# Altium schematic sheet Power supply.SchDoc (part 4 of 6)
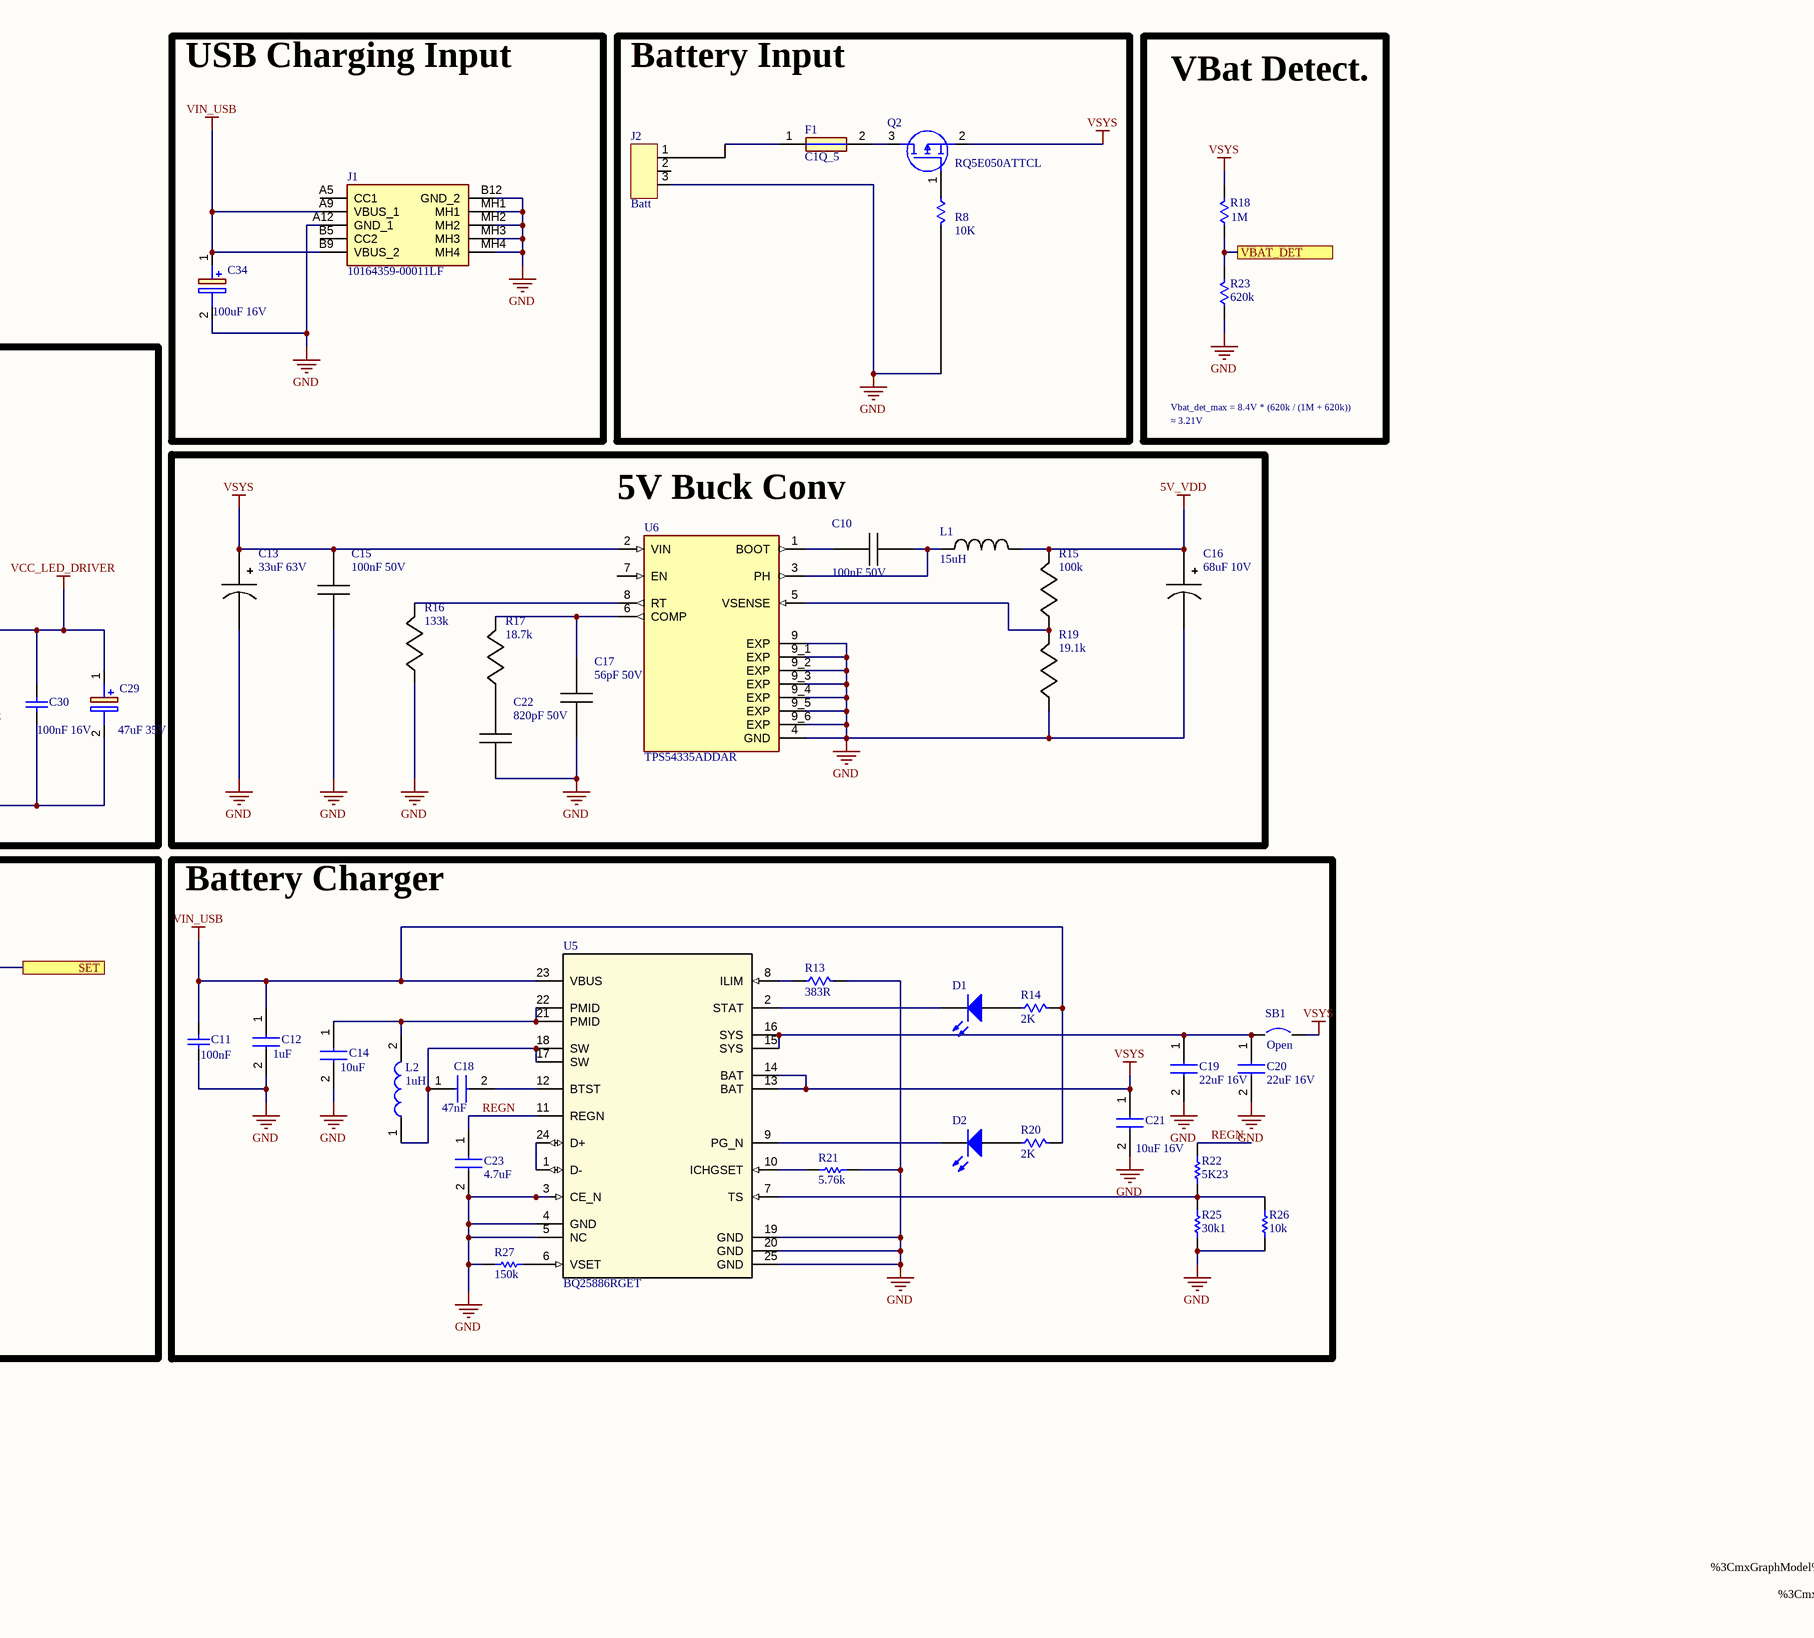
[diagram p4: Power supply.SchDoc, right]

## Notes on the sheet (continued)
6ujk%2BrQpmSkpIYIsTFxZGso9Vq4%2BLi4PyY0S9TFKUXdE4dW%2FUEgk47WcdUoPMEQok5vrKhoKNWSk7myc78%2BMEFTcS5Y3NPHhxPIg6kuZeuVidt2LQ9Izl1%2B5qUzQnJmxLXb%2Fl6TRI36JQVf%2FHvf%2F%2BboqjftOUg0YG9ijR9Mlr79HumxQKCsHRFm6M7FegMG2IHKzhlp6JBnKNRudH6Ae2QlOiAQKg4z%2FfnM%2FEgFMnZ8QaNdYrzfMtORd%2BsOAre3a6UJNMEPxqVW8eDTujsUfDFseZkHVycHXBe3LNnDwE5D5NHjx7FAtyJpqamHw5tXjhXBFHwdaUXv0wFOkbvuiIg52EyNTUVn3J6ejrkLl4c5Slx4QM6G9YtbSfowNLV781a5ouef87ejNlqlbvm0IwOWLrCl4Yu%2BY2ufLxQAB1sio5PRIaHgmXhtWvi4NONAB0m2dByuEFn5uw5KWnb%2F7lpa0LKptXrNiYkb5rxwSxmbweJzupVn8HNLxZF%2FqYtJ3V0wFACRxsKoENDHDjsVKBD7pMCQKGJczzchoJpdhfnh0rKJOg4OYrjl76MZLNr03DcdYWZfBIkZECPFIlET9t1xd4Jr0WRSNTfvoeTo7id20%2FAjk5MxEtYt12bhtM0kwoLj8DcRhPnAOnwF%2BqAU8%2BFc0WCU0%2B9iAMFTA468%2BfP57%2B9vLy8nAk6MTExWq0W%2BgN5NmphZElJiV6JjkUpI4eFeHck6Bgt1zEadEYP750U55y5cURSnLOwVoWvUIMS4GiMoijU5NULOi%2B%2FZDfJ7z8NitygExAQ8MGs2V98tTJu9dqlsXHTgt9jUk5AQACAzvJlUVMmORzOcv359OL%2F%2Be%2Ff%2Fue%2Ff2ts1GIUdHRYUYY709JBx4jt5cOG2E15y4GGODAwGhu1QMfY42mg4%2BQolrr3xcutCHRoNae9CFBTJz4%2BninRIX%2Fi42991sT9%2B%2Fdv36qqr6%2BFiPMla2H%2BmTyhwRqLmQp0%2BDcmWdIg0FmyZEl0dHQHgM4u%2BYaamsqKG6Ws73qemf5%2BL6IdnfZsL%2BejjEwbTbrkN7ryOXRuaHfGQwCjKZMcUO9YrXQ%2FnDVGMA%2BITcQ%2FwQSdIk0hemxl3qeXuEvXrjZGxMWLIyiKmhYUyLMPM4sh6Dg5iocNsft0%2FvSy0pKy0hKcuWpqKpkVJnMEHR1W4umEoEM%2BdVoauwvmM0EHT7W8Rn3s160YZmgMm%2F08eRMnR7G5JTqjRg6x79edI%2BLkd%2FDgQSboPN7JuLm52RoJhmedH2%2Fbkio4KLxJSEjA%2FqBQKDC%2Fw0Bna1pyTU1lOwWZpMHADgYdI%2BQ6xkl0gHKK88ZfPrO8OG88sA5NWEt71QiHzBZYuyZOkZW%2BNS0Zft8i9zQ2asE3CPMS43LA2bipQAfrEBoyjfb7HE8xE4IdHasEHdO6gGhs1II%2BF%2FR46JeNjVoU8DD7jUlyDAKdCRMm%2BHGG8ePHkz8FdBkMBJU0kUiUn5%2BPE9u9e%2FdoQh3%2B61Z4E5MneEKDNRZ7vKDT3NxMU0aOiYmpra3FJ6jValNSUoB1AHT278952q4rR4yKCid1dPz9%2Fb28vDw5gy7LyGQ3NjT9eEHHUNYxAnT%2BYtcVQAdMId%2B7UwqHglCHzzt5%2BbIoRdZORdbOP9zOk%2BWRcgAdTMs6JgcdF2cH2FIO627Ll0Xp1dERQOcJBR0XZweIIOh2chTDGqciayf0dfiryEonx4Np0waBjo%2BPj0Qicdcdxo6lO%2FVkdQEx7OX%2BSz4Pv3q1HGc1SNy7d%2B%2FChQtJSUmpqamPfRqGKlkjwfCssyW0cHl5eW5ubnp6Oom82Cu0Wm1%2Bfn5KSgqAjhEuILy8vDh67NixYzsl6BjEOkaDzsm88fikBNDh%2F1pG4T0qIDs5immUY3LWMTnorF0TR05SkObedSWAzhMKOthRSBamUQ6UMR%2FrGAo6HDOHVCplgg6repqZDAaqC3cv%2FbQPxIqKCnwLtyfBExqssZipQKe0tDQ4ONjT0zMqKoq%2FMjL%2Fh2K0ZWRw6qmrx44dO9bb27uzgg5%2F1jEGdJ56KNEpK46688vJCyfmAegIppD54A6CDi5OsVIOvPlNJdcB0AmaOpmHFx%2F2ItOmvUtRFPqZdnF28Je5khG30ehqBLteXUCWL1hGJonH0nV02r90hV0ZewYr5ZiVdYwAHS8vL29vb5%2B2ASjnMYIO7LqKXtBH2HXFk7pMCDod49TTUGVkBJ2xY8f6tw1%2Bfn7eraETgw5P1ukl7mLQqwzAKCnOGeAG%2F65c%2Bgq%2Bx4QERwsUaQoVWelFmkKQ6HBQDk4QiEQct%2BU%2BBaDjJXl1zJujdEvkdZ5xdR3jJXmVBB3uj2M9K4AOyTeYtlzQmTRpEpAp6%2BPkn0lRFOjlgESHg3LMxzrGgY5MJqMpLox9FMh82F7ObBBzSHSamprKLhTkqxIg3rlzh7%2FMgKMkT2iwxmKmAp3a2tq9e%2FfK5fLCwkKDDAZyNDt5qv0SHW9vb7JbBgQEPCGgo5d14D1mBOgMG2IXEz4YKUdw%2BMB8y%2FHJ0Us5pmIdAB0Pt6GDBtpJJG6eBoZBA%2B083Ia2E3R6iR9KdHCOFxIW7QJi%2BvTpJgEd4HT4q5dyzMQ6nQZ0yKnRhGlrJBiedTYV6JiwtVlvJYAOnymTo4yuveVoNMsI0OH4OOEUzxbgSTkmYR0EnTdHu%2FgaHtxcRwqgYyYsE9VbajAV6OB44Ek55mAdAXRYJ1fM5AkN1lhMAJ3OraODrxe9ch0BdMi26pg0kAe80nn%2BLSstMbpu8HGT354gMzZMnTLZVBIdS53YH0%2B9LBd0wsLCTCLRgV4L7tB49nUohhphRvd7vFAAHWQa1oQ1EgzPOgugYxzozJ33yfxPw2d8MJO2HIaHPLeXB00Lnr8gYv6n4XghLWGEwUAc18wEh1xHAB1mc5k7x6Aftzg7GF0rAB0T2tHxl7mC%2BR%2F8S24iY61nzx62IpFo4MCBjwcoLPVTLRd0VqxYAaDz%2FHM9WZ%2BoQZlojQB7M1rUxhxaoj1oT6tbZwKdn8tO7kydCfHGjcus4GJoJk9osMZipgKd27dv79y5c%2FPmzd9%2F%2Fz1pCMfQptZV3iRLV7SdJL6%2BvkYoI38Y8jf5XlXmXlXGnty0jO%2BWxcXT0AQO%2BYDOV%2FEJmftU8r2q9O9zUtN3z%2F7wr8xbmRZ0OOQ64O%2BF9mbQdUju0pK69Z0ZNEDw%2F6CrrTjyg4NktLe63sP27L01OehsTUtmVph1jy02ggA6rKxluaCTkpJiQtAxaKUW%2BlaRphB7TzsTxoGOr68vzXCgt7c3qCOT7%2BsOVkYu%2FDFDcOrJH7lMBTpGO%2FXURTa0%2FPaDjo%2BPD1MtYdy4cYZKdNK%2Fz5HvUQLobNu9Z6s8a%2FqMD8gOzxN0PvnHgvTvc%2BV7W0BnZ1b2t7u%2BX7f5W%2BZ9TA46HKzD%2FzUCoDNsiF329lGojJyW6CLsLeffhlAyMjwUNqMwiYGZo3fLIfenmxx0nBzFsMMcfqjX1FRyU46To7h7txaJjouLC%2Bt8%2F8RmWi7opKenA%2BgMcDCBRMdf5srs1tw53HaZuHs87awRoMM6bcBP5Me7vfzokTRFxt%2BTV0m%2FiR1eXV1Nmy%2BNO%2BTPDVZX0oSgExwc7OHhMW%2FePLPa0VEqs3v2sOWIkZFtLCPD9nJd3dXX13fcuHH8t5fP%2FjBk%2B3d7d2Tt251zULE%2FPzV995adu2K%2FXsUElL%2FOCT6UlwvjmtUFxNoNqdu%2F27tTkb0374edWdlwq6lBQbRbTZgg25qWTBrZog1e4w51rWHxvBuADkk5gDtpiS487yAU42gBbqeeHBdynzIH6KD%2FB0VWOlq%2B5agGgI6Hh8cTyzSsX%2FxJAR1A49CQaZHhoWSsqalsbNSSOZDm6ElGnDIIdHx9fTmmDZg5yJe1RqNxeW0w02b%2FxAnj%2Fv3vfxtHHh18ldXhC%2F8Kmwp0zP1EUKKTk5PdvZstR2SCznh9wd%2FfH3vs4sWLOXxd%2Fe2jsLSM77bs3LUja1%2FGHuW6zd8mp277LCYWL8fE7l3pFEXB2gQr6MQnrkvL%2BG7zjl1ZykObd2Su27ItOXXbe9PfxztAYsIEWWOj1oTiW3w%2FtId17Hp1%2Bcsjg4HVVzKam5trq48A6whrWNjCRiceF%2BjM%2FfiTz6KXfaJbY4x06unkKGYuXXH4IoXWEEDHykAnNzcXJDoGrW3r7fr%2BPvZpia%2Ft2jQ8MmzQsCF23E499d6NZwGDQIf2ItZ7qMvXlVQq%2FfejYO5psp33588NVlfS6kAHpPdT3nJIS3TJ3DSCabtl%2BbIo0teV3v5JK8ANOpMnB27clp6StmPtxtSE5E1r1m9euyF1zl%2F%2FRrtJQECAXtAJj1q84dv0dVu2rVm%2FOSF5U%2BL6LWs3pjHvQwOdiLAX0hJd0hJdZgYN4Dm6OYoZzTotoPPI1xUOLgAdk1SMo85PwikEHX8f%2B6S4VzM3jowJH4zLgna9unCAPsepqKhwDu%2Flqem7Mvftl%2B9Vpiuy127YMjVoGrM30kAnOEhWVlqCmsjwCwEe0OjhvZk1d3IU29raiESi6dOns873T2ym5Up0CgsLAXTs%2B3U31dib8paDRuWGcdem4fV3azgc3%2Fe372FcpClQmxt0WBdug6aMf8Q5D%2F%2FjG9PSElaHL%2FwrbI2gExMxWK1yx0hbLjEr6AQEBHw07%2BOkzVsT129JSN6UkLwp%2BssVzPmAD%2BhMnjx5%2Bdff%2FHNj2pqUFtBJSN40Y%2BYs5q1I0ElLdEGFGLXS3SRmiI1jHVKic%2BeXk4JEx1RTANwHQMffx16tlGA8nOUKnuG7d7P9i123N17vbVC0sbHhAJ34xCT5XiWAzvbde7fKs%2BITk5i9kQY6INHB7w57h1s8QjBqjpQGk6YAOjSkswLQ6feMyUDniOJNjcrtxuXv7tRVX9CEa1RuzQ9uc4BOS6exsTE4ikTP9u%2BBvdPkgoGWAAAgAElEQVTJUWwhoIPc0x7QKbuo2bLubYjXr11qz63wWv7cYHUlLQd0tFotNjgzcezYsSVLlqxYseJQXi4gTk3F0Tt11eeOfaRWuZNSBHODTkBAwIyZsxYsXPxp5KJZbPukYHrQK9EJCAh4e%2FLk2X8NWfjZ0k%2F%2BEf7ulKnMeSUgIABBZ8okB7XS%2FcAuv%2F%2Ba5Dnvb7If90gOZ43B%2BYMczoamkXX4X2jXq4vdU10zN44gwUutdM%2FZPor%2FTYSSuloAQCd7%2B2i1UnLrRs79prtlxVFqpQTkl9272Y5174cAxDPBDTo7vtu3U5Gd%2Fn1udn7B1kxFavrulLTtzA5JAx3YHg9rWKB3QVGUv8wVan7jclbLRKaOUCslK5cOhS8LoBMWFkab6Z%2FwQ8sFnfPnz8Mz6%2F10V1391aD8YUPsNCq388dC4ZHfrj7NB3RCZjju%2BXYk%2F7g%2B3llkY2MJoOPkKH7N2eGL6HDkG0hcvXo1KioqJCRk%2Fvz58fHxt27dYk57unKampoKf8wAR1cL54oqKyt1lTQo3%2BrwhX%2BFTQU6RSdyIz8SRbe6U738c4lBzatQKGJaQ1xc3LFjx2jXlpeXJyQkxMTELFwY%2BeDBg%2BobP6pV7qXFMTBMqq7uV6vcYyIG41jrANBhTgDMHD6gw7yKmYOgA84WlHtWenl5BQQEbEwYq1a6%2B%2FvY4xdvT4LcLs7nPlBe6taXZJ2c7aNA5MDnDkIZjhYA0FErJeeOzoLh0NhQqVZK0hJfh41LrKBz8uD4Mz9%2BcObHD1jRhxt0tsqz0jK%2BS03frdifn7gh9Z%2Bbtq7bwrIHUBfoUBR1KC8XJTpqpeTU4UAYoXfqqtVKSebGkU6O4gEOPWHSXLFixRNONrSvb7mgc%2BPGDXhmT9uZEnSK83xrb%2F9cX19%2FrfRbPqCz4KNBuNTFJ7Ej%2BXXLAR0Y6iEfTkHWuXXrVkjbMH%2F%2B%2FHv37tEmP12HTU1Nh%2FM2p657O3Xd28mrpNevX9dV0qB8%2FtxgdSVNBTqaEzm4q%2F%2Fq1av8mzc9PR0oB%2F%2BSrFNeXo75Q17sQ1HU5bLDapX7qcOT4U1xQROuVrmHzR6I00ZnBZ2ZQQPUSvfcXe8D6BzI9FAr3U0i0XFyFBsHOk6O4mFD7Px97MNmDTQVcuFzfJIT%2F5%2B9d4GLqlob%2FwczlV7eLP35SolRr5FCXjpmOkCMOMAk4zmaxzMqnvBkHMrOqx3IKEMmNae0RDgIhQooOooGxwuMiqKiWDMyeB2BBEUF8YKkMmSGv%2Ff3%2BX%2Fm3%2FDo03Lf58JlYK%2FP%2FsDaa6%2B99tprr73Xd571rOdB0Cndp2i6ffGXX36pr9mJchG6ROf00fdg1EC2qLuwp%2BzAmyTxcIPOoiXL0jdoV69dn5i2ZmVq%2Bqq0tR99mkDHbkbQoawOBolOaWFY%2FeUjt2%2FfvlSVq9cFpGheFkGHAjfkbucFndu3bwPoPOH%2BmLPeSfWHQwy7pcZ9IcZ9IUAt3Do6EomEDjrnTi6vv3zk%2BpXj168cP29KPXl4FglAnRB0fH08amqqgXXWrVv3KOdY9%2Fbu3St84GyLnC6HL8Ir7CzQqTp3%2FKQxDzbhBgPNZjNyDEY0Gg0%2BRJDlwKHZkTPhh6NVVWW3f%2Bm%2B0NJ9oTCNRb6AXRV0fH088luN1hRvD4AJI4pyEtkItsbtBh24kCjIsbXBufMD6LTK8AJKC8NKC8MAWYBrKaBz7uQKcsjE%2BE%2BNV04W%2FxVZhxt0pkyZ8sXK5OT0TCvorE5f9nXS5MlTeEFnhsq6JJDcQNFi7uzn9DprzRG2YC3ewAG9YdBMS0vDeooRK0t05lZwOuj4%2BngsmPtAQpO%2FcXS4fAD3qisK6OC0F9loPzVeOXdyObJOJwQdby%2F3kiMHAHQWL15MB52UlBQU%2BeAQ2J4R4dzgcjmdBTr2PQ5SYIOgo1arUV%2BHTIyPj1%2B7du3%2BfQW%2BPh7LFw0FxMlZ8wpFqtFVQcfby52cKkrR%2BHEPljYdtRt0rA9C56%2FX%2BR%2FIHauO%2FX0C0aari5kpLQCg4%2Bvj8eHcF4BU8rPHoMyMBJ3TR98jv%2FaU%2BPUrJwSCDmqMcWueUSQ69OXlFosFlp7Mnf3cgdxxel0AWXPQBpNIJFqtllLVbr7bqUHnueeek0gkvR7vQemmTtwVDjrHHwrzGXtMZVkCsE7nBJ1Tp8oAZVasWEEHHa1Wi6ADEfuGVbvPcjl8EV7hjgWduro6EmUwjk%2BKlOjEx8cnJCTwGod1IugEBweF2Bs2bcxAOzqfqePsLSZk%2FPjX28iODvmZsg90UjR%2BFGVk5%2BIXWcNuFQfQYbtlEnTIGSvGL%2F%2B5kyuAdbglOnThDWMKBXTCFeOWLo4DO4T19bVLF8dxW7bs%2F3QvkA6UlJQw1rbbJroA6PR8zI2tRzqeLhx0uHv8T41XYDqsQ0DHz3fIE%2B6PsW2%2Bw%2F4b8KWlpeXs2bN00Ll69SpmICM4HLZ1RDg3uFzOjgWd%2B%2Ffvp6WlId9AJC8vDx%2Fo0aNH8ajdoBPOF8hvOmlH58UX%2Bo197VV%2F24PPkAHwYxcMBi6IjfYdOsj2YvzHjRv7%2FHMenRZ0gHJOH3237sKes%2FpY2BUNBjr%2B2RcIOqWFYbxkUH%2F5SNuBDt4pzCnjLluk75M9AXQuXbrEW%2FNulaFTg05gYKBEIrHJ6y9bD2BLFwg63OIc6DEwgeU46ISGhgZxBroLiBeHvNDzMTfG7YUXnm9oaCDx5fDhwyTrnD17ljxKj%2BOgCJGff%2F4ZU8g4JtoRcTl8EV5hZ4HOj5Wl%2F94y%2F99b5h8qTDxfXSG8kevq6kjW0Wq15LlmsxnXZAHo5OfvYuxImBgbG0MaDJw4cWJgYCAHZAQGBrK5gLDaK3%2F5eXDfJvzv2NdGodFYBB1vL%2FcA%2F7HCC4GcfkOf9fZy75yggwYD4fPSurjGOodFLvVn%2B6yJ6dwtIBB0uOetiOdiNcbTFhIdMBiIjq4qK0zHDCUj%2FDzZ7u5Jjweg060gRsjNdmrQiYiIAD5le66OpwsEnUpjAm9r1l3YY9gtdRx05HL566%2B%2FzjZyBAQE0EGH0WBgwLihqJpDwZc7d%2B4YjUZexKGcdf%2F%2B%2FV9%2B%2BeXQ%2FrW4%2FEdcXs5LPM4CHeOx3dDsCTFPnT9%2FnoQV3rjZbK6urjaZTGxazA0NDUVFRQg6bKJBSI%2BLY%2FB1xcY6gYGBHE49h700MMSu8NqYERSJToD%2FGDtKmhA8fthLAzsp6Dx0AXH9yvHbt283XD8HEp1pk1jHOce%2Fh92kBIGgc7L4Ld7PfutzaSvQWRAbTWoiNzebuf16PuH%2BGIyYvNXubhk6Neh88cUX8Ngohoad%2BDYKBJ1zJ5fz9oz6y0ecBTpBQUGMrAOUIxB06JaRKeBix%2B7du3e%2FP7JV86l3Qkxf0Y4OL%2BXIZDJngc7Rw9uWxHnDduYU1RYOL%2BvwZkBfV7bq6IBTT%2BixdEFkcGtgk%2BhMdCBsJXxdfb5UbXdJCkVo5wQdj4egU1oYWmFUo7KOE79%2B3bao6KjpeblatttHHR0hU1dWQ1Ot5pXbQqJDV0bm9nXVp7fVdflzzz3HO1p1twydGnTS0tIAdJziwJyxW1dWmCorTIyHwKIxLC8%2Fa4jl7RlgmMcpEh0YMEJDQymfb5TMk0oPBoOBUaLTRqBT9aO%2B7FjuceuWJ05d8bKOs0CHl1QczOA46AQHB5PdUqlUhoaGcoMOJb9Nu043GMj2EXBKun3KyGDaBxHHiQYMnXJTXbUQBB29LqDuwh7uLz8YJm6jqatwxbi8XC1s9fW1FouFY7QCU4cSiUR0XU5%2FZJ0adLRaLYAOxdCwE18wjvlOEnSM%2B0LobUdJAZ8SdNABTXjSvjMuAgR%2FpZUVJvITL5fLAXQUCgWZrlQqOxx0KEIgBwdXPJ0XF1w3gwg6HFNXlO5t0253AB1vL%2Fdw%2BYDli4bmpL%2ByfNFQyjp%2FJ34GxaLIFiBBBw0QU772sIuayG0EOlirEX6eYDYQUxgj4NFTqVQy1rY7J3Zq0EG%2Fns51YM7YRRgTSTs6NRXrOTpKw%2FVzjMvLgXL69H5khXyXAR3kHkQW%2ByKuyzG8NRdBRwQdRywjM36XxMQ2bQESdPS6gJPFbzEuucVJq7abupqhUuTlboJNiEQH5AKioyv6SN2pQQe9QDjRr6dNbwgJOsZ9IWBym96IuLacoqPDSDnw1YMe6YoSnfr6%2BvT09KSkpO%2B%2B%2B%2B7atWvIOi0tLfZRzv3793lxwXUzOAt0mpqa7txugK2pqcnupmY7UZy6sunLYGtm%2B6aubL2KmN8pLUABHbBBXH0m7fqVEz81Xvmp8Ur95SOtWlO%2Fez5vI4kOXUcHDQYy3ikMK6KjK%2FoY3alBB71AOMvdlbeX%2BwyVIiszFbYZKgV0l%2BRVGkihKLuQoAO%2BI86bUimNCIutKJaRn37qcTbKgXQXBZ179%2B6Vl5dPmTJFJpN99tln58%2BfJ0EH4mxDKUe663IMb82dBTqw6ioh5qnEz0dVnTvD0Zj2HepUoPPe%2B%2F%2BT%2FO26FUmrP16kZpvPEjh1tVC9OPmbtSuSVr%2F9ThRjUejUk3HkcFaiCDrOasl2KIcOOiCz4f7bFsrINt0s%2Bn8QzSJTxujO7gLi9u3bffv2lUgkTnR3BQJAmO9sbjZHR00%2FZihBr2kUnXYK6ADNGPeFnDkaXVmWcOZoNPINRkBHBziGMmPl7eUOlNPr8R69Hreqx3NLdMLCwiiW2DpcR%2BfevXs%2F%2Fvjj5MmTFQrFV199VVNTQwcdO3CHFxdcN4OzQOf7wzm4qr%2FTgo7i0RASEmKHMvLnK1Zu2bE7Z%2BfuLdsLNubuTPpmLSOgCAGdDVv%2FbS1nx27tv%2FOzt23%2F54cf0YsSQcem0bQ7ZHZ10BHNIrse6DjdCwSsJx%2Fh5xmuGAfmJkGVfYSfZ3TUdIvFsnRxHL7MjKCDTMMYQdBhoxxIf2ag1fsaB%2BjIZLIQWpDL5cA65Pe6PVddsWENR7oQAYPrcgxvzZ0FOnWXy8tNRRWtG3qqEtK2AvM4KNFh7K4hISFyudwmHR3V9Omb8nZp%2F50PdLI%2BJy9zc%2B4HsQvIDg9xXtBZtGSZNi9%2F8%2FaCLTt2b8zdkbUlN32Dll6OCDr4uRMj0AK9Hu%2FhZleIi4u1WCzTVW%2FSu5nAFIoLCJueCJpFPnPmDH2k7%2BYpnX3qyunGkevra3GFHoBOfX1tc7N5%2F74CEPZER03H7iWRSHyG%2FMek0P8it4RYqwt02Lav%2FwN5aFLof40e2Vfi5sZNOd5e7tygwzZswMjRgXZ0OICG%2BxD3cMuLC66bwVmgw92Ajh9F0Nm5cyfII9n%2BxsRQLSNzdFfosWx2dOhf%2F3%2FM%2F%2BeGrf%2FesG17rm7%2Fjn2H1m3KWbsxZ%2FEXK%2Bg5eUEn%2Bdt1G7Ztz962I%2F%2FAkc3bC9ZuzFmTvSXyb29TihJBBz93YgRaYED%2FXv2ftmdTJyzoQNARzSJzwFxnBx37jCP7%2BniwvbR00CGnriwWS7hiHJ7eo4cbZfvNMewQ7yfC5QNgGzf6Kfp4wEs53KATxhdCQ0PJj7XBYPjdBUTP3x1BBAeP54aP9j%2FKNh67Lsfw1tzlQEen28X9lV8Uv4B0AREeHk6x9kTfDQ8Pxx5L%2BrrCRIzMfvuddZu2rsnesnZjTvoGbXJ6RsqarA8%2F%2BRQzYIQXdL5c9S8oJEO77V%2Fpmf9Kz0hZmzUjYhaWABERdNg%2BlWL6gtho2Eb4eWI8XDGObJlwxThMAe%2BbHSXRAXUIiaSzj%2BkcONJ2hyS3Onf4%2BOOPgSQE2gz09fHIzx5t0EkNOmlm0nC65Qk66FgslmOGEm8vd5i6ulyZbNgtPZj3mvrDIWSHhrhEIiE1o1H%2FC3FHCOVwgw7lQ8y7azAYhg39b18fD5l%2FP9yecH9MERbcFijzyy%2B%2FXLtaBdsvv%2Fxi3yUoxMOLC66bweVAx1bLyLz9k5KBG3SmTHkzMTU9dd2GpG8zElPXJKatSfp23Z%2Bn%2FYVSiFKp5AWdyL%2B9%2FU3WppS1WavS1iamrln1zdovE%2F9FL0cEHfpXrsuk%2BPp45KT%2FAZSIM5NG0ocDjjtdEBuNupt5uZuam824i1J%2FcLWGUwROBB1fH4%2FMpJEVhv%2B5Wb9HYM0BdJ577rnOPaR3TO06O%2Bhs2rQJGEKgKZ2Dua8ZdNLjByYfPzAZWIfSlWGiqrLCBB03eZWGklJ14uOTh2fBzBSddbhBRyDlOB103pw0EipM1ryNLCOjryvNp961tbX2gQ6chbjjuhzDW3Nngc65ytKM1ZNhu3DeBqee2MjcEZy64gWdlV8tJCU6dHTgTuEGHaVSOTNi1rKvVq36Zp0VdFLX%2FG3OO4wF8oKOUqmMnvuP5PSMxFbQWfLFV5OnTKEXJYIO5QvZlXZ3ZY%2FR6wLKDrxZduBNvS4gJ%2F0Pwu9uhJ9n8ioNyPgBdGaoFOGKcTBewAJeQJ%2B2AB2o%2Bc36PRaLRa8LyM8ew1tzGCgDAwM7BiU691U7O%2BgcOXIEnp8QUzrTJnkadNKz%2Bphbt27dbKg7WTzLoJOGyweQXeSYoQTdpIG7k3DFOOCe%2F%2Fe%2Fd2vOfF57fvetW7duXKsEuQ55LthKZpPoCKccp4OOdk2YYbcUan6zoQ5qPjFsbMmRg4wgcu3aNWNruHPnDmMGtkTwdYXLfxwEHcQdXlxw3QzOAh106vnRexJbnXrev3%2B%2FurraaDTW1dUx4k5DQ0NeXl58fPyaNWt4Qaes5Ks2BR2lUjl5ypTpMyNmvRVJ5xJMEQI61qImT5k%2Bc%2Bb0mTPxREpEBB3KJ67L7IbLB%2Bh1AWf1Hz4cDv6q1wVQhgPumwUJTaB0GIAOmNGHEQRkOQA69fW1MHvlLIlO3palrYYK%2F3r%2F%2Fn0UI0GEsi6YrD8MlBEREZ0bOTqmdp0ddC5evAjPj8QL8umS8bmzBxt00gvlWdCW504sN%2Bikwp39ZiYNN%2ByW3rhWCaeX7gsx7JaS5XOATo8ebpScsJJ89Mgn1R8Okfn3oxzlUEamfIh5dw0Gw768SWTNQa4DmkYTw8bW1FST4LJ3796oh2HevHlGo5E8yh2%2Fe%2FfuldofL1QbYTObzdz5BR51XY7hrbmzQOeYPl%2BbEanNiFz9lazqnImRVxgTzWZzYmKi%2BmHQarWUbHl5eXDw71GzQT2f0lcpuxXHE9sadHj7vJCpKyGFKJVKEXQoz7fL7LZ6CguoPpMK3%2FPqM6l6XUCkapDwG6SADthas1gs4AWWRBD4eQD5YWHv%2FV%2Bv%2F%2B%2F%2Fbf7%2FWsP%2F%2Ft%2Fm%2B79ev32rHg5x%2FIV5hj07NXqdteYAOj%2Ffqbp9o%2BTU8X379xWw%2BSId5NkHBsovvviiY1Cic1%2B1s4POrVu3hJvSCZcPMOikJ4tnXasru3LpMGjqCJ%2BXVX9oXU5VYUy4ca2y9vxuw25p%2FsbRlLeCbeqKIs55%2BqnHJW5uMv9%2BMKN0MO%2B1aX%2F0JItyLuisTZIbdkvPGmIYa07OYZ09e%2FYh5Dz4P2%2FevAsXLggkkjbKxosLrpvBWaBDoRPhuyTlANCQrFNUVPQQgdQvDxsoBHT27Fwmgg75LguJiwYDhbSSc%2FOARKfswJvX6o5fqysrLQzT6wIEDgdZmamB0mEwdYUSHSSbcMW4EX6egdJhgdJhzc3m%2BvpaqPkMleKYoQQcRTfeOPdL83lyu3ypAg7x%2Fv041jrRVloYdre5zmKxCKk5aoseOXKkcyNHx9TOBUBn%2BPDhEomk1%2BOPuItieyVWa3yBb%2BCvOpZBoZjtXKsi88bRgCbwly7nFAI6g5%2B1wrXMv1%2FpvpBL5767dG4bzCXhYi6nT12FyV%2FmrvmpU2XAKCkpKRTQiYqK0mq1bUQwAot1XY7hrXnHgk5dXR1yDEY0Gg1ykkajwfR%2FvB99%2B%2FZt3qmrpYvjRNBh%2B4awpYugw9YybZqeonmZNGesjn1RyOVQxRjIZoSfJ0xdBUqH0Z1ANzebUUeHLBwwC69%2BIPeRtVpkTsb48kXDrLNXh%2F58pTrz%2BqXvLlTkzFApRvh5kmbeyBPRiM7Fixc7BiU691VdAHRghTl9boh8zBj39fEIlw%2FITBq%2BWuM72xYpJZTg6%2BOxYO7zmUnDVyx6icL%2BzwzsbZXTsKy6IiU6IEVckTD00rnv4OlXGBN%2B8yBBYpNzJTqB0mEcNff2ci8peaCss2LFCjropKSkCCSSNsrGiwuum6FjQcdkMiHHkBE0OUgmxsfHJycni6CDHxMnRkTQcWJj2lRU63AwMkXzsk2TVrjkCtwEgc8pxuseM5SwTSeFyweoY1%2FMTBr54dwXGM%2FlTgyXDzis%2B33lF6iWsvm6QiM6nZs3Oqx2LgA6X3zxBcw%2BcneLtj4Ks1ESN7c%2FKv4rf%2BNo2L7%2BbKjEzY1iIRBAJyF2yLkTy%2BHBgrMIUlPH6aDDffuoprN582Y66Ozdu1c4wVRVVb377rt%2F%2BctfPv%2F8cw4XEMILbGlpcV2O4a15x4JOQ0MDiTIYR4lOWloaJsbHxyckJIigw%2F0q2XdUBB372q2bn5WXuwnIBnWf0T8jpWWecH9MIpGIa8vZSMoFQAdXmD8zsDfl6bbnLoAOObGF8dEj%2B4JEZ%2BniuOio6QA6JQezbtbvPn%2Fma%2BtCd5q6j3NB5%2FnnnwcWZPwbGRmJ2HHt2jUK6MybNw%2BP8kaEOPXkLYSegRcXXDdDx4LO%2Ffv3UdcYgcZk%2Bl2Xubq6GtMRdAZ59uHY1AmPGAxUKpUhfEG4wUCBGsSiMnJ7fvrEa3VUCwDooMOirMxU%2BtwZ1K3nY24SiURcW%2B7CoGPTCvO265FCQAeWqQ%2Fy7HP48GGY3%2F1%2F%2F3vXdDQyf%2BNoUkGHW0dHLpf7c4agoCByPDAYDCOGv9j3yZ70bbBX%2F4SEBApYXLhwYfHixYA7KSkpNq0wv3fvXl1d3VdffbVkyZKtW7feuHGDUrh9u67LMbw1twN0MjIycnLS2baMjIy6uqMokuGNmM3moqIi0MVJTEwkKQfOra6uBrkOgI4dLiBef%2F11jg4rk8mEu4AgOzZ3XODycu5CxFVXbffB7AIlz1ApkldpYEPzxwtioyElUDqMco%2FhinFou4QjgkVRTqfvAuigEjQs%2BKJfF5YDSySSjz%2F%2BmG2k7%2BbpLiDRsWmFOb2vOCsFQEd%2FKF5fkkHZSImOxWIBjyeVFSa6l1CsDIdERy6XBwUFsY0cQUFBrujrihuAeHHBdTOwgc6PraGxsZFCKgsXKhsaJDdvyti2K1fGJCePuXXrFuVEB3fRYKBOt2tA%2F14cG0WiM3HixKCgIDbWkclkNjn15OUSzCCCDn5MxEgbtQBpDbm52TxDpSDJo7LCRGEOWF5eda7SaNRzbLLA4f%2Ft%2FZ9sG3kv4Ypx4IQRV6RnZaaSGSAOo4lEIklLS%2BvmQMN2%2By4AOrdu3QIf5qTCL%2F1ht3XKA9D5YdcPx288spXVIOiM8POsrDABgOflagOlwyju0LGSvKATFBQUEBAQ%2BGgAyhFBp%2F25Z%2F78%2BcXFxQUFBeSl57SG32wRhYeHk%2BlknBF0fv3113mtoaioiAIoW7a8fPLk8p%2FYQ11dRUFB%2F7YDHVt1dAB0glpDyKNhwoQJwa1BlOiIOjr46XOhCCwdD5QOAxWZ%2FfsKwF9QoHQYaCsviI0mb8dxg4GvB44lCwxXjCPFOWzWH8Bmm0QiEdeWuzboON2HOdmZBMYBdA4eyDl49OIjW8lZBB1vL3ewEW6xWIDBLRYLOkYhLyQEdBQKBf5%2Bhcj4h4FMNxgMlB8WcCHSfE5L5w4kGXS2ONhU3Lp1q0wmmzNnTnFxMUTmzZunUqkWLlyY3BpUKhVjzRlB56effoLM%2Bfn5FNDZtWvojz9uoSSSu5cvnz14sG8nBJ3g4GCyWyqVytDQUBF04GUUQYf8%2BrlKnFw6DpABKjJZmanwg5aiGux00AEB0oLY6BkqxQyVAkiLPvOFS67EteWuDTrow3zws3066iUB0Hnzj69RxjNFWNAzA%2FuQ0qY3wsadPn0a5mgpyI%2BVd1HQ%2Bfnnnw%2FuW7vgXQlsTnEB0clXXRmNRplMBjKbefPmzZkzJyMjQyaTkWQTHh6uUqkY5TpsoPNOa%2Fjhhx9IiLl%2F%2F74IOhRaYtsVp67wYyJG2qgF6KDj7eU%2Bws8TpSyUX5htBDp4d1A%2BHXTQbznbMC%2Bmu8bUFa4wF%2BjaE3uGEyNW0JFIAgIDKaATEBAgkUgQdPJyN5WXn3nzzTf37MkHNR3GOrgo6ICvq29WyhJi%2Bn70nqQ7gE5ycrLRaMzJyamtrV24cOGyZcs0Gs2cOXPCw8OTk5PnzZun0WgAgJKTkyl94zdCYgSdX3%2F9tbw10HV0RNBhIxtKugg6jB8WMdGJLUAHnazMVDDcB%2FqXlN%2BxTgcdmCBDvWYALApdeXu59%2BhhXXI1fPhwEWjYWsA1QCc%2FPx8WTgtx7enEjk4WNfhZ65rb%2BPh4ymCmVCqDg4MBdI4ZSmDSCnokdFCKeBPKdF3Q%2BbG8pORQBmy3b992ypwYpUk72%2B7ChQsrKipUreG32SsQ8IS3BlDQgbhwiQ5FikPuiqBDARq2XRF0yK%2BTGG%2BLFoAP%2BDFDSX19rcViycvVgutyTKF8250OOt5e7lmZqQg6zc1mRkUIGByVSiXbMC%2Bmuwbo4MIrjycea4sOLbxMNtABGz8Wi6WywvTyMKtsc%2F%2B%2BAlBhYzTa7aKg4xSsoRfS2cjGifUxGqnqxiTW0OMHDrwq6uiwwQ2ZLoKO8K%2BWmNO%2BFoAfrvCrFZT0UQXTYrFQxDneXu5OBx2wyIwzZYwSHfRyJbrz5OA51wAdXHgl0OOVfd1ayFmMoKOapoBzAXSGvPBfO3fuVE2zqo85suoqJCRE8Wh4qIs8nvzit4Myco2AcPPmTTrBCExxIlh0tqKMRhts3ty%2Ff7%2BlpYEXdG7dyqATkoMpuLzc7lVXcrk89NEgl8tFZWT4MojKyEK%2Brq6ex%2BmgE64Yt3RxHBRbX18LcUoriUuuOPgGD7kM6HT4wqvBz%2FZ5ZmBvRtBB7TDQik9OTu75mJu3lzsAOEW8Cd2UV6IzYcKEEKYArNPOoBMWFubFHl544QU%2FP7%2F09HSBWEPP1tnoxIn1YdTR4WbjQaIAACAASURBVICS8vIIXtApLx%2FbdquuCvfm93%2B6F8f26cIPSaeesLycrbsC64jLy0XQoQzPnXn36acepxtfFZKyKH6BxWKZrnqT%2FD7bFKcsL8dWYltY7u3ljkuucFAXI%2FQWcBnQ%2Bfjjj2EmcpBnxyy8AmVkv5dfpoyCSqVyxaKXwPDxUJ%2BBGzZsCA4OHuTZZ4SfJ8xeYWclI9ygwzZsAPlQ1vEaDIZxrw2l2%2ByfOiWEjhT2pXCDzquvvhoWFuYI6NRaQ1Vtran1b%2Bteu%2Fypa8Ngqqurrqur42AaxkMdrqNjh2Vk7u4ql8vZQOdPfwq3e9u0McNisYDQNCnpK7vLUSrDmpvNxwwl5Ovp9LgIOtxNKpP2S9H4ZSaN%2BHDuCxQj8twntsXRXo%2F3cLMrxMXFOhd0ZqgUlRUmWMpeX19bWWE6ZiiheIGAJVd9%2B1pNToiBrQVcBnTQ45XjC6%2FC5QNmqwbJpP1seklgefn7Ua9TQEcRFmTQSX19PJ4Z2Pupp55qamoCQU5erha%2BwvSpXG4XEBMnTnyDM0ycOFFJBIPBwOjrSiaT2Yc19LO4QQdkPY6ADv2K7ZnCCBwdldjhoFO4t2Dws30GP9tnqnLgW9OefX3c07CLf5cujiMlOkRPFBT95JNPsjJTQbsT3hRH%2FsIr5kgJcK4IOjZ9DJ2bOVw%2BQK%2Fzxy0n%2FRXnls9dWrh8QOSjw0Gvx3uM9%2B%2Bv1wXYtLm5uTkddBbERpOayBCnrLoSNZHZ4IZMdxnQQX3kp596nLvjchz19fHIzx5t0ElhW7HoJY7MlEMAOnomy8gGnfTF55%2BQSCSXL18GGSPaRwbfs5SiuEFH0HBBZDIYDH94xYdus3%2FK5HaS6Lg66ABUdRTZUK7b4aCzf1%2BBTNoPR50DuWPVsS%2BSHdgpoEN6EUJ3QhC5Up1JbpSjlN0Rfp5LF8dREu3YZZxfJu%2Fawbgo0eFowF3Zr%2Bp1%2FpfOfXezoc6kj9Xr%2FD%2Bc%2BwJHfmcd8vXx2JU9BmkmRfMylNx5QMfby%2F2YoaSywgRAz7jqCkBH1EQmsYYedxnQQX3kJ9ztX3gFlHNWH1N9ZrXVqbhOOls1SOBrwwE6G1ePhN4GBsJJo1KovkO5CsfUFcEwgqLtoIzctSU6FOkRhTzaebczgA4MPCZ9bPWZ1UA8pPjTKaBDeR1wVx37ol7nX3ZgSvWZ1SeL%2F6rX%2BVMwC3O6VkQEHY7npdf5nyz%2BKwxO1%2BrK9Dr%2FFI0fR35nHUrRvKzXBZw%2B%2Bt6F8vVlB97U6wLmzn7O28udEXSqz6Reqzt%2B69atmw11Vy4drjCqkZAg0hYSHVh1hWuv4PczKdHBJVei8wc63JAprgQ6oI%2FsyMIrg05aWhgC93%2Fl0mGDTrpa4yvwtXkAOgf%2BqS%2F%2B4pHtYPzokX0lEskzA3ujJxTwUZKVmUp2SvJC7QA6w%2F08Yz545%2FSpMspA3tLSYjQaV6xYkZKScvjwYfpRekq3Ah24%2FXbmG7zc5s0vnzuXc489XLx4xlYXEA0NDQUFBVqttqioqKGhAa%2BFkaKiosTExPj4%2BPPnz1%2B5VKzX%2BZ8%2B%2Bi68JhfPfUehjTYFnQO5Y%2FU6f7j0zYY6vc7%2FQO4j3n%2FIl8iF4iLosD0sXx8Pvc6%2FtDD0xrXKW7du0fsb24mOp%2Bt1AaWFYTgc6HUBINShgM7po%2B9BHsrf2vO7SdZpC9ABFxCwrmX%2FvgKwH0j%2BeBY1kSkPhW3XlUDnvffec0Qf2dfHw6CTniyeBW0BoJOZNFzgCwOgg9NeZAR9XTHqCtiqoyNIjENkYpPowH0N9%2FPU6baT7LJixYooIqSkpJBHGePdEHQ6Cnc%2B%2FjjAZBp79Ohi%2BlZSYk08fDjkm2%2B8ha%2B6qq6uVhPhN7POpIq02WzWaDRwfOyYlywWS1XFARJ0LpSvp0wltAXoBEqHwbYr%2B9WTh%2F5866f6O3fu3L59W6%2Fzz89%2B1dvLHY4KfFU7YTYRdDgeCojxSgtDy4qmgARxzKi%2BHPmdcqgVsALKDrwJw8G1uuN6XUBm0kiKRAczMI6gJOu0BeiALAcEOehgiwQdUROZ8bnQE10JdBzXR96aPsqgk54uia4%2Bs7q0MMSgk06b5CnwtQHQKdo2hr4h6ERHTafrB1CU5OFy7SDRwfsa7ueJ%2BLJ3714Cch5EjUYjZmCMdFvQwdZA4UdbR4zGolWrpmZnv7Fx48Ts7Deys99Yvz4sO%2FsNrVYJ29q1k4uLk4VXg4CcB9GMjN%2FN8Gi1Wkj95JO41wNGWCyW70v25KS%2FYmWdkndx6ooceJwOOsmrNPALobnZvEe3BX8t%2FL%2F%2FvVth%2BEf%2BFhWmVFaYsFdzRGBIAAcsebmbYN0K%2BmMJV4w7ZighRwuOopx1SAQdjpb09fEA1gGuDZcP4MjsxEOZSSOtU1fWfp5aWhim1wXAcEBKdGrP76aPmmRK6wSrVW25LUBnhJ8nGC2srDDBLAHlZzP88g8MDCSrJMbpLeBKoIP6yE969LSvu8uk%2FYB17FZGlri5MW7o60pgxdoTdLy93EuOHIAxe%2FHixXTQ4RXqiKADrSccLzpJToo4B6HHbDZDDTFFrVbHfbTAZDKBMnJ%2Bq34o%2FLyOfFSPzemgA%2BQBpmbBEtXliuQr1ZkWi6Xxxjn4OQu%2FHzisiZDvHRq0JRHKYrE0N5thtLBYLIym9MlCnBsXQce57el4aYHSYb4%2BHq1M%2F2B1FaMyMn3IpKRcuXS47XR04DYZfyp7e7kP8uwjaiJTHgfbruQnlwqDBw8mPWja0d19fTxgeTn5I1VIOc8M7E1f2YQp4AJCSDmQp51B59RDTR3KvBVAz7p161B0wRgRQYfSLJ2EY3irYRPoxMfHJyQkgGVkXx%2BPaZM8I1WD6EZNnA464NDHYrGA6SmLxQIrfi9fqqivr52hUoCiGyw84TXcDO8XLgsAF0XeXu5wOsr%2FRdAR%2FrHqejnzcjc1N5u9vdxhOIhUDSKHA5TonC55l3d4vH61sq1Bh6390Sby4cOHeevZzTO4GOh0uH1ktj5na3o7gw6O09u3b6dLdMSpK2wfmyK8nNHhGcxmMymzgXhiYiJWLC8vDzOQoMPRn9sBdKKjpoPeZX19LdQE7eUInHKigw64m166OA6KEkGH4xF3%2BUP79xUA6DDeqU2gc7OhVjjofKpe8lVy6ieLPlNNn0GoWf4eZbOMzFhPjyceA4nOxYsXuznH8N6%2Bi4EO6iPbKkFh7CgdmMgBOm%2B88cajLoMY9n5%2FM5RKbmXk1nmrgzh%2B37lzhyLUWbFiBR5li4gSHbaWgXTkhk4YMZlMiDIQIRdeNTQ0JCYmQjqAzp49%2BdzW7j%2F55BEXEOCzPYg9yGQy0sQlGAzEVw8M2IDSJUp0UCkHjtpKObBKBWwAwoxVc7MZypyheuCBTgQdfATdMCIQdE4U%2F5V3BL1yUdDUlWr6jJyde7bu2rNlx%2B5NebvWbdoa8de3yM84xG0CnZ6PuUkkkr59%2B%2FJWUszgYqCD%2BsiOmA3sDC82B%2BjI5fKAgAB%2F9iCTycg3xGAwvPbqSwMH9KZsQ1%2F8r5gP3qmpqaYM0nfu3Nm7d69Ny8tvsofrNxqu32i4Un%2BVcpVuuNsJKQeqVF1dXVBQkJGRUVTE4ErdbDYXFRWlpaUB6NjhAiIoKIijx44fP57uAgLeQfBWmJerBUUcBJ3oqOnRUdPJGSuLxZKVmbogNprNXgMUmJe7Cea2SIlOc7MZ9JFJbBJBpzN8BjuqDgJBR68LuFpXxk0JFaUJQiQ6q9LWbNmh27prT86O3dnfbc%2Fakrt8VQr5GbcDdFATmbuG4tGffvrJxUAH9ZEdMRvYUW8XeV1u0OEYOWQy2fjxVO%2Flbe0CohtSi9233Glxh7tijnsvZ2Sd8ePHBwcHs4EOLioBTWRvL3c0HIIvC8VZRFZmKh6iR9C0Gqobo44OZA6UDgPRDigm00tooxRRGbmNGta%2BYoWDDreaDiro8K66yv5ux8bcndp%2FF%2BgOfb8%2BJ2%2Ftxpw12VsYQae52UxZWsV4j2gqUKPRiCjD2wIuBjo%2F%2FfTT8OHDJRJJjx5W9%2BCuu%2FGCTlBQUHBw8IRHA1AOHXRe%2FYMPRZwzcEBvJ7qAsHvU784ncoNFZzvqOOiMHz8%2B%2FNEQGhoa3BrYQAdsiKO6MexSZDaB0mEw3wR%2FeV%2F5rMzU%2FfsKUGCTlZlKuncAodH%2BfQX79xWwLWbhvYQdGUTQsaPR2u4U4aCj1wVUlCYwjqM3G2phUboQiU7m5u8ytNvWbtyyMXfnqrS1yemZKWuy6KAzc%2BZfLBbL0sVxvPeOpgJPnTrFWD0xkWwB1wMdVNPpKDfmvF1QSAYhoKNQKChvwviHgUxn09FRTQtrC86oqqp69913p02btnTp0pqaGsZL1NbWrlw6ErY9%2BSt%2F%2FvlnerampqZ9ulWQJ0%2F7P9euXaPnaWlpqa4yYVHGY3sY8zQ2Nv7www%2FTWsOBAwcaGxsZs2HNP%2F%2F88%2FPnzzPmuXfv3vnz52fPnv32229v3Lixrq6Onu3u3buFurRlC71hu3jxIj1PS0tLTU1NYmLitGnT3nrrraqqKkayuXXr1vfff0%2FWnDHbqROHVy4dlfa1bHNm5FnTccY8DiY6DjrBwcFkt1QqlUJAR8jL0gXyiKDTqR6iANBBd2%2FWxeenS96lzGFdftQsMq9E5%2BN49TdZm1LWZCWmrlm5Oj0xbc1HnyZQ3helUikcdMBUoETieiM4yR%2FtFne9Ztq1axfMTTruxrwD3z0XBZ179%2B6Vl5dPmTJFJpN99tlnbLhw%2BfLl%2BA%2Be1Hzq%2FdF7kr35K%2B%2FcuUNHgTt37mzfGv%2FRe5KP3pOsUPtdvcqs5VNddRbK%2Beg9idGgo5fT0tJy48aNvXv3glf5I0eOsIFOeXn5rFmzZDJZXFxcVVUVY1F3794tLy9XKBQymSwlJYWR5Jqbmw%2FtX5sQ0%2Fej9yTxHzzJCEMtLS1VVVVxcXEymWzWrFnl5eWMINLY2HjkyBGoeWFhIakmTOY3HtNBQ330nuTChQvkIWfFRdBp06%2BBCDpt2ry2Fm4L6PiDwAb8RZwo%2FmtZkdUrFn3jNhg4ecqUJV9%2BlZye0Qo63y5aoqFTjk2gA4OgUqlsN1Zw6Qu5Huigmo7dZgNtfSvaIr%2Frgk5dXd1XX321ZMmSbdu23bhxgxEXrly5suO7hB3fJaxPjyw17G5ubqZna2pq2r8nbX165Pr0yC3r%2F6ehoYGep6WlpbKibH16ZE72vPXpkWdNesY8t27dOnr06JLWcOrUKbPZzJgNa75161Y2AdLdu3cvX74cFxf38ccf79ixgzHbvXv3DN%2FnFvw7AbYrV64wXq6%2Bvj4jI2PJkiVpaWkIQxQuaWpqOnr06NLWcOrUqaamJkoG2D1RVgQNtT498vKlasY8DiaKoNMWrzmWKYIONkX7R5JWLauvr62vr0UjTDaCjn%2Br5UwGuCFxhxt0AGtmzIyY8%2Fd3p8%2BYyUg5wkEHhg%2BJRCIq6AjEL9cDHVTTccS7Z%2Fu%2FbJQruijoMI7oYqIdLeAglzj9dBF0KG%2Boc3dF0HFue9pUGlrKRiVfXtB5dmCf0SP72rQJAR02vsF0gVNXVn9ErUFU0OnKoANqOi6tjyyCjh1w0PVOcTqv2F2gU0Bn4qMhJCSEVxnZphHLdTOLoNOBzw5BJy9XC9WorDBxLLvz%2BI%2FH%2BvTuYcf26cIPLRbLdNWbCC62RgSCzhPuD0wFChzmxWwuKdFpNzWdcPmAg7mv2bqtWPQS71stBHRCQkJCHw3BwcGgjky%2BPwaDYcTwF5%2F06EnZJr4xoeuRQVe9I7sBxVknOg46crk8hBYmTJjAsbyc9zXpMhlE0OnAR7kgNhpsbS%2BIjR7h54nWI5ubzbg6zynVA7tQ7QA6PXpYTQWKCjrCAc4lQafd1HSmTfIE9582%2FXUK6DAOG%2FATmb68XLSj0zUAyFnUYkc5CDo63S7u37ILFsR%2B%2FvnniNoTJ04MCgpi664hISETJkzgWF7ulAGm8xcigk47P6OszNRjhpJjhhISZUjKQXNKZAYHK9k%2BoCMq6AjnG8zpkqDTbmo6HQU6HMMGjBw4zCjZXUC00fJybqQ4fer4yq%2BXxHzwTtTb0z5LiF2bnvx91X7uU7r50TO1xqTtamixmA%2FeWfn1kpIjB%2B0gFQdPQdDJz9%2FV6%2FEeHBsddML4Qnh4OPZYigsIB4cWVzldBJ12flIotkGOoVOO01kHQCf8DVhGac%2FfiW%2BM57Wj0%2FfJnqKCDhKMwIirgg6HNZ1pkzwzk4anaHwjVYPseLs%2BnPt8ZtLw1RpfmbQfHXSOF02%2B%2BOM2aNybDbVXLhaf1cdQ5D0OSnQeNbrGsIdjBkTQjs4CqPkXvjL%2Fft5e7u0MOiu%2FXsLY2kMTJGOW9Z276U9nao3dnGkot5%2B8P2FogmRogmTU%2FMdJ58neXu7D%2FTyj5vzl9Kk2MZnDiEQIOrgyhfFpenu5O%2B7U8%2BC%2BzBSNX4rG78O5L7BdhSN97uznMpNGpGj8wuUDOLJ1qkMi6LTz4wDQwckpNspxLusA6ARKh%2FkOHcTuwof1yIjhL4LlbjAY2DqQjUzRvDx39nNk64kWdATCDZnNVUEH1XQoTq9SNL56nRS35QLUZcg%2BdCD3NTjXoJMezH1NHTuEhJiK0kVk22H88nkdmc1B0KFwDO8ugM7BvNcMu6WwHcx7bdofPdsNdEqOHCTbkBKHsRxw5%2FOCeZTBvhPu3rt3D5%2FsvXv32GqI2TjysJ2715SLzTI0QTLl6ycP5I0FPCVbb7if58qvl7S0tDCiiXMT2xN0rl%2Fa1rpe17pqN0XjR94ybzwzaQSeq9f524dKvFdxegYRdJzepNwF7t9XsHRxXF6ulqKXA2RD%2F4tIxF0s91EEnZeG%2FB%2B57WHYS54IOssXDSPXrqdoXsZLixZ08PssPOKqoINqOqTTqzGj%2Bup10rKiyVfryq5cLC4rmqzXSWVSq3hDyKaOHaLXSU%2BXRF%2B%2FWnnxx20kuxh00rP6GI5mJfO3P%2BisTZIbdktPH7XW3Epdu6X5G0e3D%2Bh8lhDL3bb15SvN1Wm4%2FVzPbPSPjQnaP728vPydd96RyWTz5s378ccfGStAmijcu3cvm4lCxnPvXj%2BCrQGR6rKP9LtZh%2FyoOdOgHOeSDaU0AJ0vvviCV6KTu2UJqaPDC%2BKUDJ988sn1S9su%2Frjtal3Z6ZJovc5fuOR12iRPvc7%2FRPGs1hf8sF7nfyB3rK%2BPB9kD83I3gdEUyt9jhpJA6bDkVRpKOu5GR00PV4yrrDBhCkTgRPISbHEonOKNKysztb6%2B9i%2FTptq0StRWMIIqzVAp6utrKRVgq60T0%2FNyN1VWmEhXG7yFQ7NgU1MaGW4Ej9paOHl1blkOSTyOsw6Ajjz41UfXkAjdk08IDpWPtVgs365eBPYJoZ%2BDiUIYyEQXVxyjMMchVwUdVNMhPx9zZw%2FW66QXyrPghitKF%2Bl10mmTPMl%2BzxHPSR%2Bl10lvNtTC6cBJiDvXr1ZytOPNhtqTxRGQuf1BZ1%2FeJMPu32t%2B%2FMBkw26pr48HigTIEffatWsrVqyIioqaN2%2FeihUr2EwSk6ewxXO2rOdoTzhEAR1zdVrz5a1sBXaGdFtBh8MWM%2F12TlZuplCOuTqttuJbvc4%2FP%2FtVtsZE1oECKYzCu1tUVKRuDWlpaSaTiZK%2Furo6MTFRrVZ%2F9NGCX3%2F9lRd0Ko4nOgg6Pzc9eMUun9fpdf7LFw1lu3FKujr2Rb3O%2F%2FJ53cMXPEGv8ycnsBbERpNDFyWel6ulpJC7zc1mXIdMplssluZmM8UDF6VisAtnNTeb8egIP09IbGpqIr9UmIEtYh%2FoYLWF1Jbt0ramY6MdM5QIPBdct2JtIVJZYYJqz1ApKIfgEdgEUlgTVNahlMmY7iDrAOg4vurq8L7lel3AhfL10M8vlK%2FX6wLg94DHEw8WlosWdDiGY%2FohFwYdVNN5ZmBv6NatP%2FisIhm4zxPFs3glOoHSYeGKcXB6ZtJwvU4KKjg3G2px%2FsvQKuahtx0lpfr06o4CHZDoYM1hAgtf9ZgP3sER986dO1GPhsWLF%2BNReqSmNdy6dYt%2BiHvGCq9OBx1zdVrGwU%2FpBXaSlFu3bun1%2BgMHDlRUVDA6r2hpaTGbzVVVVQdbw5UrVwTOXn1ftX%2Fxlgl00LloWqnXSTOTRmCj0SPkQ8SGoiAL465WqwXKwb9GoxFzVldXY7rPfz9lsVh4Qefwvi8dBJ3Ga4fh3akotZIKRQWBfu%2BYMnf2c3qdPzpZLCuaotf5k%2BpN3KATHTUdR2XKsAdDKfdRXiegWCZWGJ2lWyyWdgAdqH9lhQkr0NYRssUEXpf0MI8tBhFgHUoi7nJYvmG7TY5rMYKOxWKpr69lK4033Vmgk7dlKTjYgtfEpI%2FV6wIA6Hs%2BZl1YLrq4gpYR%2FteFQQfVdPo%2B2RO6oK%2BPR372aL1OeqJ4VmlhiF4nzc8ezd07KytM%2BH6GywfoddLSwhAgJL1Oiho%2FP574krdNax9q6rS%2FRCf6b68C3Jw8PAsilDrU1FTD6Lh58%2BZHOce6t3fvXhw7KZGM1nD8%2BHFKektLS8A4QT%2FEGUHnT6u8uuFqrAkrvRlBxzp1xSd6HO7nWXLkIP0p3Lp163xrQHYhI2azGTkGIxqNBvOkpaVhesTMN4WAzsqvFjoIOtcvbSstDC0tDAVtG8rcE8cL6%2BvjcSB3LMxewbkUOkTQqawwhSvGkRtgygg%2FTzIxXDGuvr4WhlJSopOVmQrZsECLxcIrUcAhGW%2BBDjoj%2FDwXxEbjhmuCvL3cwxXj0HRvdPScd%2Ba8DfolWJq3l3ugdBieixG4tRkqxdLFcVBz8hSIQ%2BF4Cv668%2FZyRxszeJT3TrF8vGWLxYIfUjzKGMEGP2YooTfy%2Fn0FWCZMJpICHiFuvcmLMoqO8HHjhSgRsgSb4s4CnZVfLcxJ%2F4NeF1BW9CY4SM%2FPHuPt5T742T5AOTNnzuQdj8QMZAu4MOigmk6f3j2wO8qk%2FWAGCjCF9xsK08B4%2BrRJnnj63NmDQUSk10mFgM6Vi8UdJdEJlA6b9kfPrWtGAeWs%2FsIX7wgiJUcOwBi5ePFiOuikpKTQR1BICQoKkslkOTk5lAxCJq3g0qTWLRn%2Fa4aMUmbX3s0sWUnePhmf8vWTQiZYGZWuSkpKPvvss48%2B%2BohRZ5kU2CDQqNVqs9kMrEMmxsfHb9q0iVei4%2FiqqwsVWwBT8rNfFa5CB92p9QV%2FBU6nKzIjlwicRqmsMOEgtyA2GuUTCBzeXu740593%2BMei8O2jgA6jvgiY68Wc4J0AiyJvhBzyMYPFYjlmKCFFF%2BTcGdSEfmJzsxluhw0F0Igw3gtjhJwNtBV0yPbE20HQISuAlbQVdOg3jhfCx4opECGvy3jLHInOAp2li%2BN8fTwyk0aCPnJm0kgYyNDzw65du8hRXIzztoALg85PP%2F2kVColEgldJszLN9hZKaAD6Xg6gg5Oh3E06IXyrA4EHUrN8QYhcupUGWAEaOdQWEer1bJBhkKheOONN%2BigI1Cc4%2B3lTo7olHi3WnA%2BYaU35fZx1%2Bfvv5M65cFRdvE54vPasmWLTCYLCgrCFJTW3L9%2Fv66ujkQZjGMe0M6B9Pj4%2BISEhHYAnazMVHzFKDcocJftdAQdEM%2FA0hu2MimU4%2B3ljqBTWWECc3MofrBYLKQUhLFMHDLxKOKLxWLp1%2B8pjsE1Omo6nk5GkB44xmyLxUKCjsViIXV02E4E1sFbJi8KcYFDPtYcq4q3zxjBJm0H0AF51TFDCUju8W9zs7m52Yy7GHFQj9uJoANNR%2BnnfXr3EOetOIZgjkOuDTqbNm2CBz9wwAM1HcZXiyOREXQwP4JOaWEIKimztebxoskdDjpYczISMG4ojoJnz56lUE5UVBSHPnJ5a6B4KW%2B82UCWzx3H4ZweSd6fgBXr2pHGpgb67WOKcNBZk55MaSitVjulNVDSQcBjNpvJySkAmry8PAQd1FNWq9XtCTrcfcbuowg6OGyz6RHTKYcEHTwdI0JGfcyM9SdBZ8OGDZjhmKFk%2F74Csg7JqzR4FCKHDx%2Fev68A6Yo8un9fAbnNUClG%2BHmSrEOCDp7Y3GyGs8gUBJ3KChMcJWtFloM3RYl0ctCh1BZ2uZ16Mp4iJJEbdN77x7xM7bacnbtT162Pnvs%2BZTUi7HL7uoLBLjAwkG0MEtPZWsC1QQdnr8hF5kJ6JOYRCDp6nZTNiA60rBOXl4eFhXHb1AwODiZfEjQYiDdFRgLGDW282UCOgocPHyZZx2jksuNnbg0UZVuBashQjeKjMWWln1K2P63yGpog6T6zV2g45921oyhNUVb66ab1fyMfGUecsvyqpaXlxo0bAKPkIybjtbW1JOtkZGQg5dy%2Ff99sNqO2sn2gM3HixICAAFYjaP7%2BgYGB7eYCgg46FouF3p7kWE7OUuGojyiAESHiCsyMVyRB5%2FDhw5iBHiEx5TeV2KioORRBNVlnPJ0ifsN0BBRc9mWxWFCZGmU8pFoSaguN8PNEoQtiFt4RPSKCDrYJB%2Bi8%2B%2F7%2F5OzcvXXXni07dm%2FK27U%2BJ%2B%2F9eR%2BQn3Fe0MGF5ampqWzDuZjO1gKuDTqMi8yx2wmJCAcdcuE6pTVRO8cpEh25XP7666%2BzjRwBAQF0X1f4XSNvOWDcUFTNIUe%2BlpaWq1evGlsDJV3grnAFHW8vdzZl5KEJkgkrvQVe0dWzoRFkRmXknZvnkg%2BOIz4xbCylKe49DJR0crepqamqqspoNNbV1ZGUg%2FG6urqioiK7QScoKIiNdQIDA9vTqSeCTn19LajW0l8NkhhIyiElOmBobkFsNCloIadaGJ8RcgaKf0hyEg46C2Kj6cvLSb1pvBBFeRzT8a5J0ME6hyvGQU5G0LG%2Bsw8VtB0BnUDpsBkqxQyVAisDFcDCyfbEmjtXRwdvmRLhluj06d2jRw83O7a4uFg27%2BVrNmze%2FO%2BCnB27c3buWZ%2BTl7n5u5Q1WTaBzpMeDzw%2FXLx4kTIAibu8LeDyoKPRaECgh4vMKX2ae9cm0AFzglfryrBZr1%2BtraAxcwAAIABJREFUrChdBHyDfykrnhgrwOu9nJF1gHIEgg6j7io5%2Ftkd5zUSSN4yB%2BiMWdbX7jq41omfF8yDiSoHQYechbS7BZBvyIjdlpHBqWdQUFBgYODrtBDcGtpfokPq8JK9kYNySNAhAQgVa8iBmSwT4yTW5OVqyd0NGzZwgE59fS3KRaDmdNCBZVlICUgGJOtgIrIFI%2BhwS3ScAjqkKIuyLBxvAWVI3l7uWHMEHfIJYqKtysj4aCgRbtDp9XiPZwf2mTHlGZs2Nzc3DtDZsG37hm3bN363Y89h%2FbpNW79dv%2Bnb9ZtsAh1YWD58%2BHAcfcSI8BZwedA5deoUgA4uMqf0ae5dW0EHjOuUFoaAOUHS1o5zQScoKCgkJOSNR8P4h4F8Q9imrtoOdNamJ3O3KnmUA3S6j0QHl1x1BtABQiIp5%2F79%2B46DDmVGValUhoaGdhTogIHgrMxU3JJXacgBtbLChIcgEigdhmiyf18BJJJgxCveGOHniSXgyA2rojyeeIwEnbxcLWzJqzQwo8QLOmDWGU8klzvB9BwpfEpepQHWIUEHbxnRzXGJTqB0GFJIfX0tgghM4mAjkEyDTdrcbKY3MnkX8BRwyRWjt8tBnn0G9O%2FV98me%2FZ%2FuJfy3Li%2FojPfvByv7hP%2FlBp3E1d%2Bu3ZiTlrkxLXNjYuqapG%2FWJadnkJ9xiLPp6AzyfLCwXKPRCB%2FdxZzYApJG1w%2FDhw%2BXSCS9HudfunLMUAL69vDVg98uHBaiUBkZgYY74qypq6DWoFAoKG%2FCQ84ZT6a3P%2Bjs1m0nUYY7HpHqQ9%2FGLLWuxuqGOjrBy%2FvTW0P2T6HOKdsCXoF4uhjo4BBLRshBlEyHOKy0oqdDCilg4OjwdNZBCc0rr7zCWDjAAS%2FoMJ4LidFR00kaoFQYp%2FPoJcxQKZDMSBZBoQsv29HLBGEYB%2BjgndLPzcvVkhpClAx0NSkwE%2Bz2MEgkkj69ewhZmGIf6JwonlVeusj0Q0yroTWrpzZy4wad9%2F4xLy1z47%2FWZCamrlm5%2BtvE1PS%2FzXmH%2FIxzgw7OW508edL1R%2BwOuIOuADp0E8lsXyL8KYNSaPskOhy4Y9BJnTJ1FRQU1GlB5%2FSpMrYWpqfj2iJ6pPusujpTa6TfPqY4surK7gksyolGo9ERHZ2goKDOINHBSRnKGAm7vKBD0QjGQgRSDnR%2BknXwRJiKQuUYLBmlFFhz0O%2BhT13ht4s812KxAFjQa05iASPrwDcQCQk%2Fid5e7ih0wSkw%2Bnvt7eVOiouwVgBMeDuQThYOS74xP0ZQsYmRdcjb8fZyH%2BTZp0cPK%2BBEzRq8PWu0Xue%2Ff9trKxKGvvTf%2F9Gjh9uA%2Fr0YK4yJtoKOSR9DGZzraoopuMMNOkqlMnru%2B18m%2Fisxdc3yVavfiX6PTjlKpZJNogPzVn379qVUQ9wV2AJdAXToJpKxQ1Mi%2BLEAiU6gdBgIeHh%2FuFDKcXyXV0enM4DOvXv3ylsD3QXExLCxAhsBh3N65GJDFWW47cK7k1NH0lsAUoSDDlq4xoa6d%2B%2FendaAKfZFugbowCBKzu9gHF75GSoFppCRrMzUQOmwEX6eyas0ZHperhalvwI7PBBA8ioNzuN4e7kjuIQrxmVlpuIlyMKjo6bjLubHizLWHMUwlJpnZabiGisooVXq82C%2BLCszFckDTiR1ksD%2BclZmKhaOdaBHKLUib3lBbDTcJqVwKIRyIiUPrJbHVqKbt%2BnZ0%2B0%2FPXoC4pBilf3bXhvv369HDzfuaSybQKfmx62Mo2nD9cunWr3SQgV4QYeRbCiJjKCD81bvvfceY03ERN4W6Aqg09jYOHjwYCGzV8mrNDNUigWx0bAcAH9MoJ1Q%2BpvcRimuAjoRreHgQarzgZVfLxHYMu%2BuHUXfxix17z4KOkAesPAqeHl%2FemvMEObVklETmXd5uUDu6TKgI7BbtnM2OrhwV8DW%2FNyldbGj%2FZ%2Fu5ebmlr16JIk4GN%2B%2F7bVnB%2FYhzeXTb1846JSXLuIYRBuuX0ZPJm0HOjhvVVxczFEZ8RBHC3QR0OGYvQLDXJUVJvwR4%2B3lTpGsOuIdl%2F4WCUkRAjphYWHhj4Z21tFpbGwEiz5FRUWU8bLxZoNA48hsysh7TbmUMrv2bmNTw5hlfR1RRtbpttObiG4ZmZ5HSIpTQEfxaJDL5e2sjCzk1euQPLaCi635O%2BSmOuqivR7v8dKQ%2F0CyOX8281p9RV1NMaZEzRrco4fbIM8%2BbDUUDjrX6is4hs%2FGxsaq0ylw3bYDHXTkyV0T8ShHC3QR0OGYvQKxDSmzoVMOPQ%2FbG%2BKsdF7QkclkIbQgl8uBdUiBZ9spIzc2Nn7UGk6fPk0fLAWqJDOCTtLu9%2BkFdvmUvaZcu0En6u1pjO3TSUCHsbuGhIRMmDChPe3oOOv1dHo5toKLrfmdXuHOXKBEIomaNRjw4nRJNA5vNZVbITF79Ug3NzcOrWSBoFNWNAULZ4vU1xrbFHRw3io8PJytDmI6bwt0EdC5cOECLDKnr71CiAFFHDbKwWyk4Kft3nZu0GEbNkJCQoB12gd07t27V9Ua7ty5wzjKCjGowwA6FzIYS%2BsOiSfL15ur0ygbr8FAup1AbKuysjJta8AU%2ByKOSHQ4uiuwTrvZ0Wm7F9bBkm0FF1vzO1g91zqdBB3TD7%2BrCaNQB0CHQ01HIOiQFMU2lDZcv9ymoNP3yQd2Ajdu3MhWBzGdtwW6COg0NjayzV7t31cQHTV9%2F74Cil4OkA39Lyn7abv3nwN0wsLCQvlC%2B4COkCEz6u1p3K2Uf%2FDd4qMxuFWVp7XcaxZSctfMc6%2F5%2BsVcbA2IfJ36J4425KCclpaWW7du1bUGB5vLbtAJDw%2BfyBfCw8Oxx37yySd03VKO2%2B8ah2wFF1vzd41WEngXPXu6oZ2b0sLQ%2BlojjHOoGrwiYahEIhn8rKNTVyeKZ%2FGOoNfqK9oUdMR5K95HICRD1wEdjtkreH%2B4ZTkk8bCxjq%2BPx%2FJFL%2Bl10gO5r2UmDR8zqq%2FAN5OejQN0cEgQGGm7qSuBYye3RwhyqdHcTX8SWGbXzvadMYNsFsZVVzJpv13ZoyuNH7VPU1BAZ%2FmiofD5zkwaIZP2Izvw0sVxn3%2F%2BucDOSc%2FGCzqtxqusFkoO5I6dO%2Fs58tJC4hw15z19zKi%2BOemvwKVTNH68%2BSkZpk3yPJA7lrHmtoKLrfl9fTzImlO8XlPqSd8Nlw%2FYlf0q1PzDuS%2FQM3SqlCc9ev6nR8%2F9216DLlpaGEpZ6T3ev1%2FPnm4cdQ5XjIMFYh%2FOfQEKyUl%2FJVz%2BwJxVr8d7AEiVFobyDqI1ldvaDnQGP%2FvATuDMmTN5ayJm4GiBrgM63GuvSJPkJNOwxSlmy%2BGd2ZU9Wq%2BTolnkzKThHO8S96GuBDotLS2NNxvYprFgRJ%2BcOvL7qv3tM2a7xFUamxrQLwQddHx9PE4feau56XK73QsJOikaP%2Fh2lxVNgcGPHDjbFHSQcuDSep1%2FpGoQ96tEHqXX3KZfI4AppYWhsJQmM2kEWTh3PFw%2BgGw0vc6fpDRbwcXW%2FFhzaDcn1pz7rjvkKKitoFAHmh3%2FrkgY6ubGb0rH28sdKQf7OTA9go5e53%2F%2BbCbH8NnY2IgdtS2UkXHeSlxvxf0UeI92KdBhm70ivdiwkQ09HY19wcvc%2BiGTwqxtw%2FXLJ4oj9Dop%2Fgiw9YVvB9CZGDb29KkytpHSaDSePXuW7ah96Y03G0qOHPwsITbq7WmqaWETw8bGfPBOZsnKxqZH3KfbV3iXPKuxqeH7qv1Lsj%2BAFlNNC4v54J016clOv9na2lqTyVRbW8tYckNDQ0FBQXx8%2FJo1a74v2aPX%2BaMaZuXxLyljdpuCDogl6mqsy2hB5SIn%2FRWBL5evjwdZc1gOI1w%2BMXf2c3qdP5iGa33BZ%2Bl1%2FhRpFkdNoOaXqwsaGxtBQZWsua3gYlN%2BoEO2mvv6eESqBqljX8xMGpGZNCJF4%2Ffh3BfI%2B8pMGqHX%2BZM1P5Ar1EoWR4O06aH%2BT%2FeSSCSjR%2Fbd%2BOgi8xlTnnFzc%2BNeW44VAzZquH65sbHxcrVOr%2FMHMR4JOqWFoRwLr1Cco9f5twXoiHYCeQlGYIYuBTrFxcWgkvz0U49jb4YIWjqnAw1bCgV05s4erNdJq06nQMu2fkal0yZ5Ui4kcLcdQAdqopoWRrEyZzQaox6GefPmGY1GxsFPTOwaLWA2mxMTE9UPg1arpdxXXl4eHPx71GyLxVJVccA63j%2FU8QTaUMe%2BiB27TUEHJBP48QJ5El6aOyKTWv0TUWq%2BXJiNIvx9D%2BN9Y2Njeekim0AHpn6w5iATwgrbBC6kgUEsgSMCiIZ27YBNp03yHDOqL0zklRaGni6Jrjz%2BZdXplPLSRTDRgzOD3DXnuG7HHhrQ38o6%2F%2BnR86Uh%2FzHev9%2FokX3d3NwkEskT7o8JqRhgMWrhgKoNSMJI0NHr%2FE8Uz0I1IHy%2BjY2NJOW0BejgvFVcXBx5XTFuRwt0KdBpbGxk83vFaASdDXEgnWIYFCQ6J4oj6muN1%2BorSgtD9DqpTYJx8vVrN9D5zaA76SDpwoULDyHnwf958%2BZduHCBMvhx7%2B7atcu%2F24TLl9tv%2Foi72e07SlIOAE1u7u8WjIqKih4ikPrlYQMtFgtIdEoLQ%2Btqiq%2FVV4CCJwn0bQo6IF0oL1104%2Frl82ez9Dp%2F4bMwMHRx1Jx8AelxmHuCUQ3X75BzdvRTyBRACrLm7SbRIWve%2BmkK1ev8oT4mfQzjIN1w%2FXLV6ZTSwtCc9Fewza%2FVV1xqFWzkZ79K3lqnjQ9%2Btk%2FfJ3v26d2jZ0%2B3Xo%2F38HjiMQ7bOfS7ACFczY9bbzy0cQzyPwro6HX%2BpYWhp0qi62qK62uN9bXG82ezcMYKp8ycLtHBeSvRv5UdZEM5pauBTlxcHAh16GsLo6OmW5163jqJ2%2FX6MnAKccxQQtkoJsnhJUnR%2BJJerpYveon%2B8ghMaU%2FQ8fZyP%2FVwDmvdunUU0ImKitq%2BncESHcewmp%2BfH9RtAtt0D9k%2BNTU18%2BfPh5SbN29efRju3r3766%2B%2Fwt7PP%2F%2Fc0tICcbPZjPGmpiaMwzL%2Ba9euXb16Fdxu3LhxA065du3ar7%2F%2B2tLSsmbNGpJUyGrQ47W1tcgxGNFoNJhTo9Fg%2Bj%2Fej759%2B%2Fb%2BfQWRqkH4%2Bdbr%2FMkB29vLvU1BB6Qy5NVt%2Bi3BXXPud9PXxwOGfLw6KcfiPtfby51ec3J6qE0lOt5e7pSawy1crtZRPveU3Ybrl00%2FxOD9YsTuGXneVupUGVAhDG4cJ%2BzooIMtwxFxOujAvNXgwYMpT03ctaMFuhrooEEdNgFmuHxAZtLwnPRR6tghvN7LKa%2Blr4%2FH3NmD4XSbdCQp5Xh7ubcz6JSUPPDhsHjxYjropKSk4MgnJFJQUAAWk3n%2FzpkzRyaTLVu2TKVS8WZu%2Fwzh4eEymQz%2Bsl1dCOhcvHgxLi5OSNM5nicrK2vnzp0CyzGZTMgxZAToqqWlhUyMj49PTk7ev6%2FA28u99TUZkZP%2BCl3HpU1BB4hBHftiTvoryxcNtYly4C3jqDn9NaSk%2BPp4fDj3hcwk643b8YKPGdUXVGHoNW9r0Gn9ND0HNYfpP0ZBDuMIAawDGjz0mlOaqIvtYm8hoRZAZ3vWaJs254IODBASiUSj0TA%2BNTHRphboaqCDs1c9enAtL8TXldt7OWZzeqSdQQfVdDZv3kwHnb179wocOCGbcNBZuHChTCZLTk7mhgk2yGjr9OTk5Hnz5kEl2a4lBHRAcGJTG9qdWavVFhQUCDydUaKjVqvx9NTUVGQd%2B7yX0xeQc6fwLi93%2BrvWGQpsa9DBewQphXDKgdHC9EMMRW6HBXbDSK%2FHWx2ju9kWJBJJXFysxWKZrnqT%2BxXgOIpOPZ9wfwymJsR5K5uAhi1zFwSdjRs3sqkk019abtCBcuz4S584o1zauaDz%2FPPPc1QyMjISB7Zr165RQGfevHl4lDtSV1d37969GzdugJyGjQzI9IULF6pUqmXLlnVO0AkPD8%2FJySErTI%2BvXr3abDbfuXMHpSD0VmIDHZiuoud3JMUm0GlpadFqtYgyEDGZTFiB6upqPIqgM%2FjZPhzb4s8%2BotjRCeELEydOxI%2B7CDqUTwHjrq1ghIXsyn4VF0ywffTp6eCcklwPjwV2w8gzA3sPHGDPtvizj5wFOvA9DwwMpD8sMcWOFuiCoIOzV0IWGfKCjsy%2F3z%2Bjnxe%2BRc3ykri5OQI6crmcW9M3KCgIhw2lUmkwGPx8h3g88RjjNnXqFBzVIHLhwgWcwEpJSWFz70A5q6Wlpbq6%2Bu7duxcvXqTTgOum8BLYW2%2B9dfv27Rs3bty%2BfZveJpDCBjps%2BR1JtxV0mpqaCgoKgGY0Gg1JOVANk8kEch0AnZ07d3JAs0QiiYmJIUFn4sSJr7%2F%2BOkePDQoKEl1A2AoutuYHHAEVJTuGAXBO6So6yJ2WvZYujnMK6MTFxcI7KLp9sK8z08%2FqgqDT2NgYGBgIHYUXOHhB55%2FRz5MKyLzx7NUjHQcdjpEjKCho%2FPjxFNAJlA6jv%2FzcrgOE8w2Oyl0SdHgRTQjoYBO5bgQNBup0u%2Fo%2F3YtjWxS%2FgAI6QUFBbD02KChIdOpp63JxO%2FLD65%2BZNKK8dBH9Ky8kBXw2kQrU9E9Kt0rJykzNy92Ul7spXDEO43m5m%2BBjGygdBkdJfybOAp2YmBgYv4Q8ODGPkBbomqDD6w4C31g7QKe0MMT0Q8xDixRWs4Hk5hTQgZEjgBaAcgSCDrmq3PEBOCMjo6ysrOtJdISDzqlTp%2BhGaBxv2E5SAoIOKCPjC0KPUJSRJ06ciCvw5I8GcF0ugo4d4GKfRAft%2Fgn59NPznCieJc5eYYevr68FOyNZmamkIZLKChPFmxC%2BMgA6SxZ%2FuvCTD%2B3bEld%2BYbFYAHREd%2BX0Lmp3StcEnQsXLvTt21cikfCqJNsKOmiVC1u8rqYYrCQD7jgLdIKCghQKBSm5USqV4x8GMr0dfF01NTWp1epuDjqHDx9OTEzsJFzi9Go4DjrBwcFkt1QqlaGhocGtQZy6shVcbM0Pw7Ne52%2BrGjJ%2BxxobG00%2FxAi3r4hA0FUjI%2Fw8LRZLVmZquGKcxWIB31hgjw3QZ4ZKgTb3R%2FhZLccC6JBUZF8cQEectyI7p4Pxrgk6pDPzgQN6c7yKNoEO20cEPULoddLuAzoKhSI6Olomk0VHRysUismTJ4OS8vvvv69QKFQqVWRkpEwme%2F%2F992UyWURExNSpU%2BVyOezOmTNn8uTJHCXI5XKVShUREYGnREZGTp06VaFQOF4CVBvqoFQqYReqTd6FXC6XyWQ4dSWCDrxHbBIdEXQ4vjO2gout%2Bb293MeM6vubsw5waGDfqFBeusgOV6Ycd%2B3ShzhAB2zJBkqHocF9uNMRfp4zVAoHt%2BDgYKvrddF8jn2dmOWsLgs6J0%2BehGlObpVk4aCDtuEZW7LVu411Dqv7gM7cuQEnT%2FaXyWSffvqpUqlcuDCgqMhbJpOp1WqFQpGaOjYjY5RcLler1TKZbMeOIcuXv6xUKj%2F99FOZTKbXD4qJGT116tTY2NjfYKKmpn9EREBERARATFNTH7lcHh0dPWfOHIVC0dTURyaTzZ8%2FPyIiQqVS1NRYLxobGzt16lRKHZYsGb137yCog1wu37RpaHr6ywqFAupQVOSdkDBy8uTJcXFxv5nPMRq9584NUKlUUIfa2oFTp8opdRBBhz5WiaBDbxPeFFvBxdb83l7uYBiawzET44eLTBRBh3yOFNCpr69FrAE1HZzAqqwwkSc6EgcfXqL5HLJbOiXeZUEHVZJ79HDjsAsuHHR4m7vV7lZXBh2tVgvCD9BriYkZDaDzr3%2FNUSqVS5aMBtBJTbUKeDIyRgHopKZapT579w4C0PnXv6wmBE%2Be7B8TMzoiQrlkiXX36lWPiIiAOXOmLlwYIZPJWlokcrl8%2FvzI99%2BPQNBJSIicM2dqZKSVimQy2ZIlc6ZOnUqpw%2FLlLwPopKZGy%2BXy3FxvAB2oQ0nJQACdxESrqMlkGjh3bkBk5GSoQ0PDU1Onyil1QA0ejUaT2BqcPmfUSQoUp64cGZ94z7UVXGzNj6AD%2FlB5P1aMGU4Uz6Lbh%2BS9ta6XIS93U1ZmKgV0mpvNsM1QKQKlw%2FbvKwDcycvdZLFYYOrK8abo07uHqIbM2DkdTOzKoIMqyXQfn9gjBYIOegrkaO5L1QVdW6KjVqvnzJmjehg0GsXJk%2F1VKlVNTf%2F58ycnJ8uLi4eoVKqmpj4RERE5OQGbNo2NiIhoauqjUqkOHRqSmjo2JubPV696qFQqk2ngkiVyLOHqVY%2F58yenp1tlQiqVqqVFAiVs2PBqZGQklFBSMnTlSllMzJ9raqwXNZkGLlyo5C5h796XN2x4NTraWiWVSmU0ei9fHhAT8%2BeqqqdUKlVFxSAoQa8fpFKpGhqeio5WpacHFBQMxTo8vFer1EetVos6OnQXEKiMLE5d4VeFHrEVXGzND1fMSX%2Fl%2FNlMjm8U9yG9zr%2BbOH%2BgPyAyBSQ34B0oOmo6qaMD2UCW09xsBoXl5mYzebrdcfTiOXPmTO4nJR61tQW6MuigleRej%2Fdg63wCQafy%2BJe8LVtXc8i5oBMaGvrGo%2BGhLrKg5eVOXHUFyshoWQ4iycmRO3Z4q9Xq2tqBiYnzV6%2BevnXrKLVa3dTUR61Wr12rWLvWOmcEu1u3jvrmm8mJifMbGp5Sq9U7dngnJUVmZERWV1tL2L%2F%2FqWXL5ufmTjYarSUcOSJRq9UFBYqCAmsJhw5ZCzQaR2m105ctm79370C1Wl1V5Z2aGo11aGh4KjFx%2FjffTIY6tLRYS9i8edzatQqNJg7qkJc3dPXq6YmJ82trrSXs2OG9fHl0RkakyTQU6rBkSVxu7uSSknFYB8oti6DDATpyuTz00SCXy0VlZPjy2AoutuaHq3w49wV0x837vaJkAF%2FcbN%2FJbpU%2Bws%2FzmKGkvr4WPB6O8POElVZkI0RHTYexo7LC5CxxzpMePUGcI1pDpnROx3e7OOhw%2BPiEXisQdIRYp3Au6EyYMCGEFuRyObAOubyl3VZdUUZ9xBQAHa12OmAKUAViCuwajaNyc38Hnaoq74yM30EHMAVBBzCFXoJW%2BzumAOhgHRhLKCkZV1DwO%2BiYTEMZSwDQaWh4SqP5HXSgDpRb7g6gU7g3f0D%2FXhwbox0dxu4aEhICrCOuurIVXGzND18zUNOxb%2FaqrGiKuOSKRJn2j4tePB0HGrYSJDe7dOC1kjxDpQhXjGPr0xKJBAwGniiO4G2nyuNfOEuiwzZs4MhBAR3%2FcUPpNvunTQ11lv4Ho0QHIUMEHWe1cweWgzo6dlhG5uiu0GNF0LEVXGzNj18wdeyLZUVTeD9WlAw1lVv1On87XKjidcWIgy2AasjZ2dmUpyPuOt4CXRx0bt68%2Be6774I8kNdKMr2nIujoddIrl0u5m9smOzoDB%2FSWSCSw9L2ywkSCy8SJEx%2BdsGLYI%2FMbDAZGX1etWr3OGToZQSctLbqoyLrGqqRknEYTl5ERCTNNINfRaqdrtdNhygnmoTIyIhMT58PEUEnJuMTE%2BViC0TiKLAFELPQS0tKiExPn40V5S8jNnazVTtdo4qBKRUUyxhKw2lCH3NzJarUa6uCgRKe6uhpdLlRXVxuNRngetbW1jPGGhgZMN5vNGHfOU%2BQsBUGncG%2FBIM8%2BHBvd1xXZG3nj4OsqXD5g2iRP%2B0ZWXx%2BPaZM87dYmGTOq77RJnnabALav5raCC0d%2B7vr7%2BnjkpL9i%2BiGG%2B2NFHr1yuVSv8582yWoJhmNzpM05ihVySCbt58gjc6Tm0Np2dzbhNQdxjkTS9Udksu%2B1W7zrNyv%2BQn3Soye%2BVOGKcbhBIu6GK8ahRwUSdLiFOqdK%2Fi4cdAY%2F26dHDzeJRALLwSigwztUUDIYDIZRI198L3LwotghCbDFDBn24n%2F86Y9yzqHNhoOMoEOBgO6wa%2BvUVUZrgIbWarV4em5urkajgXRwRAVxo9GIrsVNJlOrhlOTDc%2FJgawIOmjmFV8WSoSyvJzSG3l3P%2Fnkk%2BuXtul1%2Fnqd%2F4Hcsbaa4gV3Tni6rSNQZtIIOFev87fVZsyYUX13Zb%2BKl1bHvkhpGY5dDnBhPIstP1n%2FzKQRjOfKpP3ys18VyDq1Vs1Cf%2B5Jq3D5AGy0A7ljbW1zxkoKTPT18cA2560nvUxKzXlhjlKCOvZFvPHMpBG2cnlO%2Bit4OncLD%2FLsA7%2FGZ86c2W5jf7e6UNcHnZs3bw4fPhysJA9%2Bto%2B3lzusG0SblXm52uio6bhrsViam82gX0aCjl4nPVEcwSjXQcoRMnWFlIMSJsdB59NYf71OWloYcu5UyoniCINOmpk0vK2VkbsD2VDuEUmFThQVFRVzaEGpVE6dOhWS2eJTp05VKpWQhy1OFrxs2bKWNgjCQefb1YtIX1e8ZEPJAKBj%2BiHm3KkUGAaEC1fAJp5e53%2FuVEqrNQd%2Fm%2FxQwrhVVjSl9TWZpdf52wQrMOKafoipPP6lrTVnAxfKyIq7jPmF118m7ZeT%2FkpZ0ZRLVQUc41l56SK9zp97STno%2Feh1%2FpXHv4QbP5A7FuvZ1pEUjZ9e53%2BqJLry%2BJdlRVP0Ov9I1SDhF4XHVF66CGvu6%2BMh8HRA6tLCUOwtbGTJWCDU%2FETxLKw5B9M%2F4f4YgM6JEyc4npd4yO4W6Bagk52dDd0I1pnDcsG8XO2C2Oj9%2BwosFkt01PQFsdGwwapCRtABmDhV8veayq21NYcuVRWAXo5wX1d0yvH2cnccdLZnT8TJtRvXL5UVTTbopAHjhq78esnpU2X0YdFoNK5bty4lJeXs2bP0o%2FQURomOVqs1Go0ZGRkgk8jIyEhNTdW2BgofdJldDtA5dOhQYLuEf%2FzjH%2FQHxJ3S0NBQUFCg1WqLioqamhhERCUlJYmJifHx8ceOHeOV6FQcT3QQdG41GOGDBaohwmkDRvqayq1w%2BoliK6wI5yT4hX3tSvnNmzdvXL8EIiXGUYqeCOM9qr9cqiqwScDn40ZZAAAgAElEQVTACC70q2AKY36b6u%2Fr40GCUW3NoWtXyq9dKb9yubSmcitiIm%2FrwXh%2F%2FmwmtDmwUbsJdfQ6%2F9LCULg0CJ%2BEy%2BGg5pXHv4TTgXWEC3WAVOCXbetHdYpNhCe85ijOGT58OFRV%2FOv0FugWoENxfUXaRQBZDpj0BuYA%2FybwxaFIdEigYYtzWEZmpByngM6%2B3EkIOjdv3iwrmqzXSeEWhvt56nTbyYFwxYoVUURISUkhjzLG6aCj0Whyc3MTExMzMjK0Wm1Ga9BoNGlpaampqV2GbCg3wgE6hYWFL7dLmD17NuMzYkusrq4m70Kj0dTW1pKZNRoNZJAHj7FYLLygU1bylYOg0%2FRTBXzIAHS4JQo49nt7uX849wW9zh8H3VMl0TaBDohkbly%2FBFeHn%2Ftk%2BRxxmbQfiBbImnPPR5ClMYILmYESZ8xvR%2F19fTw%2BnPsCOYcCeLd80VCBsDJ39nNkmwMhCTyXclO27gJcniieBW0OukTCxSrTJnmC8A9OtxV0YJYQRfggTxJ4C1BzRDTumuOqclENGZ5UW%2FztFqBDqiT3f7oXG%2BhUVphIyvH2cpdIJNOnPJO9eiS5bc%2F6A1LO%2Fm1jyEPZq0cuih0icXPDaSl8Mdgo55mBvU%2BfPk0R79u0e%2BjQIZi6OlEccf5spumHf%2Bp10pz0UXjp4X6eOLAdPnyYgJwH0QsXLmAGxggddFq1jI3V1dUZGRlGo1Gj0YA4p6CgIDU1NSMjIzExkRxfu0bcFUGH3vIZGRn4lLVaLWT45JO4sWNeEgI6Tpm6Ki9ddP5spq0TQKByUVoYev5sJogW9Dp%2F7Oe8EZBwnCqJPn82E6RBwknF28sdcMH0QwzWXLh4gBFcOCrMmJ%2BsP0CeTfX39fEQPnGDdYPpQpjBwdlGPNrWEWhzeGSlhaFClKaxSkgb506lYM2FtwAQ3oniWa0f1Ri9zj8n%2FRUsnDcCnAQ1B0hi6y0w2yCqIbcF32CZ3QV0Tpw4Af2pT%2B8ejKBDpxwAHYmbG2WTv95%2F%2BaKXYHt7xiDKUeuuREIBHQ7KkUgkjoDOb3ZpDx06FCZ%2FOUXji%2FiVnz2a8j6XHDkAY9vixYvpoMMr1GEEHbVajcIA%2BmjaJVM4QOfSpUs%2FtEvAZVwIKxwRijgHHwpOYGGKWq2O%2B2jB%2BfPneSU6TlRG5lUQoQ8npDKyrZZ8fX08SGVem8Ytby93UPIFOLNp3srby50RXOh3hymM%2BR2sPxZua8SRNrf1WpT8lDYXPm8F5ThSc18fD5i9gieen%2F0q5aNKqSpld8yovqQgjU0QhavKly1bhqOyGHF6C3QX0Ll58%2BbMmTOBdUImvAa%2FXJcujgNr33m5WoosB3rtMwN7UzaJREKu3oJV4v2f7kXJRnZ6bsqRSCQm0xmbRDhkZgAdWCYWLh8wd%2FZgxt8Npx5q6lDmrQB61q1bxzFYtrS0sIEOOUx2hzgH6HA3YEcdhaVb9EfDCDrx8fEJCQntADpbt3w7bZJnpGqQrctY4LWSSfvNnf2cTUqp5PvY%2Bpo8Z9%2FkC6xsnzv7OVtrzgguZK0ocY78jtSfchXhu2NG9Y1UDbK7zYVfiJ7T7jaHorDmNmEKVgNam%2FGjinnYIlhzDkUocVW505mGscBuBDq4znz06FfINVa46orDciB2ZUbQochvMLO3lzsv5TwzsLcjysgAOq%2B9%2BtLAAb05Nhxot2%2FfTpfo8Npr4Qad1NRoFO20zmHx7OK4m5ioTk2NY9tNTdWkpj5QH1GrrTnJ2bDW3d9nx3jrQFwlMTU1mtjlqgNmg4jLgQ7jgyPvAqeu1Gp1u4FOVmYq%2BY50hzgHuDDevq35GQsREzt5C6A4Jy4ujnF4FhOd1QLdCHTIdeYhE15DwznwMvD6K3lmYO%2Bnn3qcEXSe9Og5oH8v%2BkslhHLoysgTJ%2F7%2F7J0LVBRH2rBnBgRGiSgEGXAmQ%2BQqyk1RB4mIIMTRjRLlkrgrMUE2xLARgmQ3oAESEoyJIiBeQYaLXAaRSyMX0SCrA64xIoobjFEwRMXv%2B%2F8gZ%2Ff7%2FM%2F%2Fn%2B%2FMz8yrlbJnupkZBobE7lMHqmuqq6uru6uefuut910VMtqGhDoAOmoNBqKpX6lUikDnl19%2BIQl1du3ahX6liqgdL7Gx36O%2B%2FokCslL%2Fw0IqlcKvJSUljx9bHD16FHbr63MfPxYi9Z1%2F%2FOOrx48VJgdh6%2B3dMTQU%2FnRv5%2BDgjv7%2B7Wj38eNNN29%2Bhe36%2F%2BMfT4pVjtzCZ%2BvAQkO4VHr08WMLpCLd3l78%2BLEHIrPu7tzHj19DxSrr8CsGoXSI4IhA1VZ4%2BtWrVy9evAgpeLy%2Fv%2F%2FcuXOQjscfPHjQ3NwM6UNDQyiOl6ltHGzz4BeCKyP39%2Fej2wGg09RYZzXThCZ8%2FLcPcWVksVjs7%2B%2B%2FjHrz9%2FdftWoVemLBYKDqy%2FL7TtEWXLTN%2F%2Ftuvd%2Fr1THiHH1xzKjlPF%2Bgg4Q6%2BPSThm%2BRgnKU%2Bjp%2FCJlVK1kAYfdOF0g0MyX7DdWQclRBJzAwcOnSpb7Um7%2B%2FPxo2kESHNHdma2Pq4jhr63tv%2F%2FDDTdLQ%2BMsvv1RXV%2B%2FatSs1NbWtrY30q9pdGtApKSl58MDj8uV6GEqlUumDBxZocD19%2BvRPP%2F3KPVeu1N%2B7J0Tcc%2Ft28b17%2Fmj355%2B%2FunMnHI279%2B59dvfuDtjNyMh4%2BHDTrVtPcCo3N%2FfBA%2F%2Fr13%2FFqQcPhHgdfvqJBYvelYab61Xq4IFOqqzDa2j355%2B%2FuncvBtUB5wMdvJdXVlYWFRVBk9bV1R0%2BfBji586dQ3pRFy9e%2FPLLLyG9t7c3PT0d4v39%2FcnJyRAf49%2Fe3l5Y%2FF9fXz84OEgqbWho6PTp07m5uQA66B1BoEyKxMfH46Az8gQuW7aM%2Bmn1Xb58OeMCQltw0Ta%2Fhp0Yk23ytABaVc4YCRwVU8ae4fkCHVyoo%2B0TD6CDFH7xiLeHBQ46fiJXoBx7e%2FtFC53xE9naKDw%2FkLSVSVNXgYGBy5Yto2Idf3%2F%2F5ct%2F9V4OoINMOePn0q%2FBwH6KTTlqejx%2B3Au%2FK3ctHj9%2BjO8ODQ319%2Fcrh9jex4%2BFsKtUE2l5%2FNgf2z36%2BPEmbPerx4%2B%2FGhwcfCqB2PT4sRQr1v%2Fx439gu8Jn68DC6jD4%2BLHFs3XwwM7S8vjxa9ju0ceP4%2BCkUDj%2BV5USSNBA2n3w4AHShhlSbpBBw%2FiDBw9IBY7fLjIY2NRYr%2Bo3DU8hKSMD6FCxzvLlywMCAhjQmco14nDY%2BOtJH2dAh759fge%2FMkYCx44vmpfw3IEO%2BmC1mP6rRwhNXhsNQadKWjw8%2FMjScsbQ0BBoAt3o6QYQUUs5aiU6MA8ATAPuyuEvSln9dKMBnVXBi8dvXHy2ZAXoYCkK0ME2fFcBOthPCtDBdhWgg%2B0qQAfbVYAOtqsAHWxXATrYrgJ0nm4K0Hkaf6zM5oHtKkAH21WADrb7vEQR6GirjIxAZ%2Fny5aue3VauXBmg3J5z0IEp76lcI036GcjDgI7mbfVbzMmIczRnFL3kfO5AR2ehzhPQOZMsaz9KCrhEp7OjfWhoqKurSy6XZ%2B3JyNqTASu8qCiHBnRCQkKe8syT%2Fwh6UDoN6ODmc8Z1uP7f%2FxsHjscPHrTgp3v48Ndf%2F%2Bu%2FBml2h4d7f%2FnlV1gh7f7yyz%2BGh3%2BddiHtkk6K79Kf9L%2F%2Ba5DmpPiF%2FL7j9fX1uikjI9AJCAhAjyVEGNAR8rlAObjEV5OBmQEdTVrpt5uHEefoBV80L%2BR5BB3dhDpPQOdC7YVvHzwTLv2IQEdgZ9befm5oaOj8%2BXPDw4%2FgPRwefnT%2B%2FDnVGSv0lqqdulq2bNkYQUfI57afO%2FP7Hp6Zq9NXC3zxxWcM6KBXUl8R3ShHB7s7%2BqowU84EtAAjztEcUPSV83kEnVu3biE3n5o%2F1gA6Z1rLzvz99jOh%2FZq3h4WxMdtqpgmHw25raxsefgSGedJTkyLDQ%2BRyeVtbG0kvBz%2FvGEHn3LlzVEvGli5x%2BfFHsjKyvoZGppzfTQvACjUGdPC3cuxxnSmHAZ2xN%2F5kLoER5%2BgLXzQv53kEnYcPH%2Bbk5ICIRXNNHQCd0D8s8n92CwleZmtjBqWxWKzz588hIz03eroHBvrlcrmXlxeNrZ2xgI5YLF600JXmrV4VvJiR6%2FxuiETvFzI4OIjW4TOgQ%2FMeafvTWChHyOeaTOFoO9ulbQ2Z%2FAZpASTOEQgEmo%2FTTM4xtsBzCjq3bt0SCAQsFkvzpRDQcy3183uWc%2FyXLl2KKMfWxtRP5JqemtTSXJ%2B1JyN8Q0hhYWFoaCgN5YxRR0csFrs48UZ9Yzs62r%2F44otdOm2fffZZZ2dn6s7E8A3BTCC1wDd171y7ENvZGvPlpxtIP4VvCN7w%2BsrAFcv9%2Ff1f%2B0Mg%2FJr7dcS1C7Eo3B%2F49j8e%2FnTr2n6UEhkevDIoQLUolPI%2Fyi11Z%2BL%2F%2FM%2F%2FNDXWonQUSYjfeujQoaMabKRV9GMHHfGzW1BQkN6VkWH916gPvGEzjJFywPmMDiYwDHvVzNk1aQEkzmFceI6RXbQ6%2FDkFnYcPH3722WdaCXUEdmazeWbJyckk0Fm9enVAQACamQJHWnK5fHj4EYh2hocfRYaH0LwDVBKdoKCg4Ge3gIAA0EdGWp8agk5nR%2FumTZtUbSJrkvKnP%2F2JIAj6S6C5Oj3%2B5O7Go5qk0%2BNZNC%2FqjHRRByHqIERgayA2SqB6rK2NqbERm8Nh21ibjqim4i7J7vTWw7v64P4dcDgvI0T%2BvpYmU8g2mfBiY6IjkMiws6M9a09GemoS3ixBgb4ff%2FwxyQKQJrtjBJ3AwMAglU2PoDObZ2ZsrHAkx2KxzEw59B8PeItNcHzslAMGc2fzzCa45szpxrsFGHGOVnSix8zPL%2BjcunXLwsIChDoCO037FCrQQd0uOM9KSU6E5eXpqUlyubyzo53mFVILOmqHDfhExu3oPFegAwN8ZHiIqnXEcU1RO%2BQkxtp3EKKu9i0PHz7s%2F%2FGsjBC1Shepvcs46%2BTvnY8sMN376Tp6ky9%2F8yakr145a1QpI846qE3QqccIOqdO1U3lGtGExMQEVYOBVI8rPLF6WV7O4bBfMDeOj7HftcPFzkYBPeiSJ09k7JQD4hxjo8l4dZOnnX%2BjNWHEOajHm%2BDI8ws6Ogh1hHyuWtAZmaJCL15nR%2Fvw8CPwSX6jp1vI5w4PP9IWdGiGjaCgoBUrVuASHfuXZtEY7Iefzp8%2F95uW6MzmmdlYm378tw%2FT0tLgm36C%2FyKRDLrRORlzOwjRT30X4Y290r5FRoiofD0i1kna%2BjICnesXk%2BHYB%2FfvoEQnh2mjKmdk7cmIiY7wE7n6iVyrpCUkYdsYQaempsbYiE0TVEFn5cqVz0oeyXtisRg9sbq5gJg5Ywqbza4uWPDjjfL%2BH8%2Fuz5zHZivU%2F9HtmAwRvVCOyRQOi8VSy9aT4RqZOujcAow4Z4LhBj%2Fdcw06uKbOqEIdgZ2ZrY2pWtDBvYE2NdbJ5fLQ0FAXJxshn5uYEAN2dOD1%2BDDWPjtjbmaKM%2B7PliTReVbPQc0eGjNWr14tFostLS1HHfXb2trGCDp5e9%2FIzpibkzEXr7mG77yPp8XOBIecjLmJsfa6%2BRCebm4MrjZYbLa%2Fr%2BV81xdoPJjq%2FSdrKxMYfnCPZjsTHDoIEcAKIhVSg2xYw8tMcc7OmBsbJQDWMZ9mvD%2FTDWHNlfYt1y8mo10ZIWKx2TNnTIFyYqME2Rlzs59tcxAZZu3JEPK5ME%2BKLFLCUWMEHTAYKA60RjUnXRTJMjL%2BNGoS1w10LKYbs9nsy99shM7r8jcb2Wz2pNJi0SPlwCwnqdlH3d2whped4Zad4abDGyrkcz%2BMfTk7w21ngqMOhytfcMfsDLcPY18etZ6TKsMYa658wV2yM9w08evOiHNw8pjg%2BHMNOlotv4KOzG3ePFUdncwUZxi%2FbW1MZ8yY0dbWBrIcUDRG8bKDnmhIa5UuEgdawztPAh1NRguURywWOznycAv9auNj19Hp6dgKlT8jXbRhzejqz6g78xdZgiIL%2FC0%2F6KkD6wDoVBd4n67w6aAWnKCT6j0isDODfgqxzlwnc7iii01BoKaTmfKMu4%2FYKAG63TJClJ0xV8E6xmxz82dYB8%2Fj76tgVviaJz0tqM3lcjl6ohBJJybEoEseO%2BhsWMPDa5WdMRcVLuRzDQI61lYmbDb74O7FP1zL%2F%2BFaPkh0dAMC%2FFr0FTc45WRnuMkIXxR2JjhqdWmt0sXo2FbpYtQ1aVKIONAaHSsjfMsOemly1GTIM8aaZ6a44BeemeJCc1GMOGeCyYZ0uucddHCbOvRCHUVfxmbHRr9CAp2Q4GUyQjTXyRzZPn4rKqxKWlwlLY6JjnB346WnJsVER%2BxMcJARoivtW%2B79dP2Ha%2FkyQlR20BNejDGCjiarrjo72rdv366J6rFqHlBGvt1z4Ke%2Bi1DzOskCmlea9FOdZEEHIfrhWv5PfRe7L2zrIEQ7ExxIeUbdnW5ubG5ujICJaoZo1HLGkkGVdfxFluUHPTsI0Rnpog9j7UmFAyvAVAvoGvuLLGlYR0E5bDaA1Kbw2TJCdPmbN3%2Fqu3intx5XAJLL5VXSEnQuMNSEg85yf58xKiPjNQflIYRZhgIdgZ2ZyRTOC%2BbGa1bOWrNyFpvNnjw6OganHBiwLzat7P%2FxrFJdzLdVuljzdwQG7CvtMU%2B7Jt%2F8ve7oARs1UitZKCN8f7xR%2FlPfxSvtMTLCNzbqpVGPmgwZ8Jp3X4iXEb6aS6R8PC2AcqDNL51eJyN8aYRhSJxz%2BfJl0hjM7E5ACzzvoPPw4UMNDSUD6MjUWUaWESJH%2B6kwf%2FT6umC0KAbUkGFkgg%2F0B%2FfvwE2FkQ%2Fe9okBnf7%2B%2Fo0b31DlmFFTUnf8RS6XDw0N4TXXXCrTQYguNgXBsQ%2Fu3%2BkgROVPCQ8uH7yDDQ8%2FGh5%2BBPMmoOcEKbBmbbq5MZ%2F%2F4qHs6EPZ0VWF6zXvxPXbn6qyDlX5yrHnycTWw4cPAVaA8GbzzMxMOSw229vDImKdbfRGPiAOi8VCSiewOEutAtDAQD9ofXV2tHd2tIOhJlxNx%2FFli6hNkZossyLlSU5OHhgY%2BOnONzJC1H1hG9wyvOZwsQaR6ICKLq6MzOGw6b9MqG6NftMNTjlCPjc26iVADbhl1y%2BmyAhfzaUyZQe9ZIQv1jUpxmwNWwnG%2ByvtMXDqn%2Fouygjf7Aw3DQ83bDYZ4Xvp9Dqo%2Bb2frssILQhP%2BSni%2B8O1fDj8%2ByvZMsKXagILiXMYR%2BXQXBP%2FlwEdRZsjQ8k0XScN6EhyPIBybG1MQYXCT%2BTq7saDQQg0kWG5zY83yuEew0czvOdjBB1XZ9tR%2BwtAh%2Flz7da%2F%2FoeI8PWah7WvvZr15Ttyufw%2FBm%2Bq1nzU8wr5XAAdWGH0443yDkKUv3c%2BfiC0EjKuWJCf29Jcf6On%2B0ZPNyzRT09NUmhj2NvDwFyQ95ahQEfI52rIOv4iSxDgQaN1X9gmI0Ro%2FbnATqFbbTKFw%2BEo1ktzOGzzqUa4%2FinI%2F1A3ClgMcCkOWXKjpxuHaVycAw3rNGfGm2%2B8%2Fv7Wd7UKXh5CuVze29OK1xxUiFDNDSXRQcrI8AEtyfGYDMrIk4FyhHyucqrR9%2FrFFHjYLn%2BzkV66gL99Qj43f6%2B7jPDt%2F%2FHsw4cPldpmiikwUh6q3blO5jLC92LTSjj1jzfKZYSvthNnVIWPazqqOeqatEI0kKIhwgOBEBVcMuIceDwM%2BJc1yGyDgydPngRSMZ9K6WH4Cei0bpN98%2Fkz4Uyyt4dimTqsMAekgFcUPr4hDp%2F4nU1Bl88%2BWUiMVDrGAjqrV6%2Be76bGfAupj8BrRfpp1F1YzPzPS0mqNR%2F1WCGfC0q7F5uCus5tgbknUncwMNA%2FMNAv5HPd3Xi44jaySBQZHoKDzvuxr083N56wgPMHXK%2BGrANoe%2Fnsm8hGjibNBXmUH8oK8zyXz77Z2RQkI0ToadG8EB1yQvtDzS%2BdXotqjgvwDCLReaKMfHYjdFeXzxpeGXmSUI6Qz53rZF6nnD%2B6fHYjzKHUSRZqfvdhzO5sWnn5rIKQaCQTasuEma%2FOppVXzinmrWSErwG%2FQ9TWkCpxZ4KjjPDVreZzncxBEobavFW6WO2JkDgnMjKSGWwN1QIM6DxpeTBwzOGwkUUc0lP7BHSeWofDtTWRU08hnwtIAdMKYDaws6Mdvrk3rOHVSRbAgbiCZ2dHe%2Btom6f7y1TBcc5MUlVVd0HOhIsBtI3%2F4%2By7qjVXPZFqylwnc2AdoBxc2wMyqwUdnHLA9Q%2BS6IS8%2Buqoq8z0mMFkCkc31pnrZI6s5tRJFtDM36s2mmJFVaA10kfGnxa1mTVPHPW%2BtzTX09ccTEP5iegcj1DVB1i2ID%2BXKgNVOigj78%2Bc9%2F2VfT2XvjC4MvLkoRxoMX%2BRJYy7IJbAwZSqSfH0TeGzkT6ythNPc53MkVpunWQh6TMGP8tkiyu7JgXryAiFVpO2NcfbvE6ykKrNjY2eWLn89ttvDTXMM%2BdlQOfJM4CEOlRWTAB0Wip8VAMOOgX5uUi5BEXwnl31c8fdjScOWUITcLu3unUWMdERVdISbQNBVJ9pbTrT2nSyutzLQxAc4ODlIfDyEHh7vgTBy12gNqhWcq6TueqFQzaYukIDcGR4CIlyBHYKV2KixS4wdfV%2B7OssFmtiLKpZW5mwWCydWQe%2BtlVbQ%2FMUqt5T8xLwnO5uvIL8XPrHAKn7UJ3aIKCDlJGX%2B1ou97U0rDKyKuUU5OfCZOuNnm70sqMZ2JjoCLAF0NnRfqOne%2BTDxk%2FkCgYL9LtwjOqW4c8AVZzmDaU6BE8f4%2BF4Uapx6HZU%2F3p7vrTAS6hIV9MR8b3c%2BapFqaaMseb0bQ5GrlksFiPOMSxsMaDza%2FtHRkaCJEBt7wOgg6y5kCJUeKT6Xv2GUgoLj1U83aRSaW1tbUNDQzO2NTU1NTY2NjQ0nDx5sqys7LhyKy0tTUnervllAuiAv3fQZwLoQSMudBYnjq3I2v1%2B1u73pYXrbWeZTuVSTjJqfmpNco6ddTQ5y28oD4AOAlMdIggFNL9qkP8v8LCoLlhQXbBgua8ljfBV82J1yKlKOUI%2BF55h%2BLCRy%2BUjfu5AjwqUzEChHhoKUoaGhmbMmKG2n1GtktVME%2FOpRkhRXTXD7ztlw%2BvBldh28uTJhoaGxsZGrB9qbmpqOnXqVE1NjVQqhY6otLT06NEjokXPWHyY%2BIYCJTwWixlnfx1nDRJjbsCvzf7tt98C6Kh1NmRrY2pt